# EAGLE design Central Control (EAGLE 9.4.2)
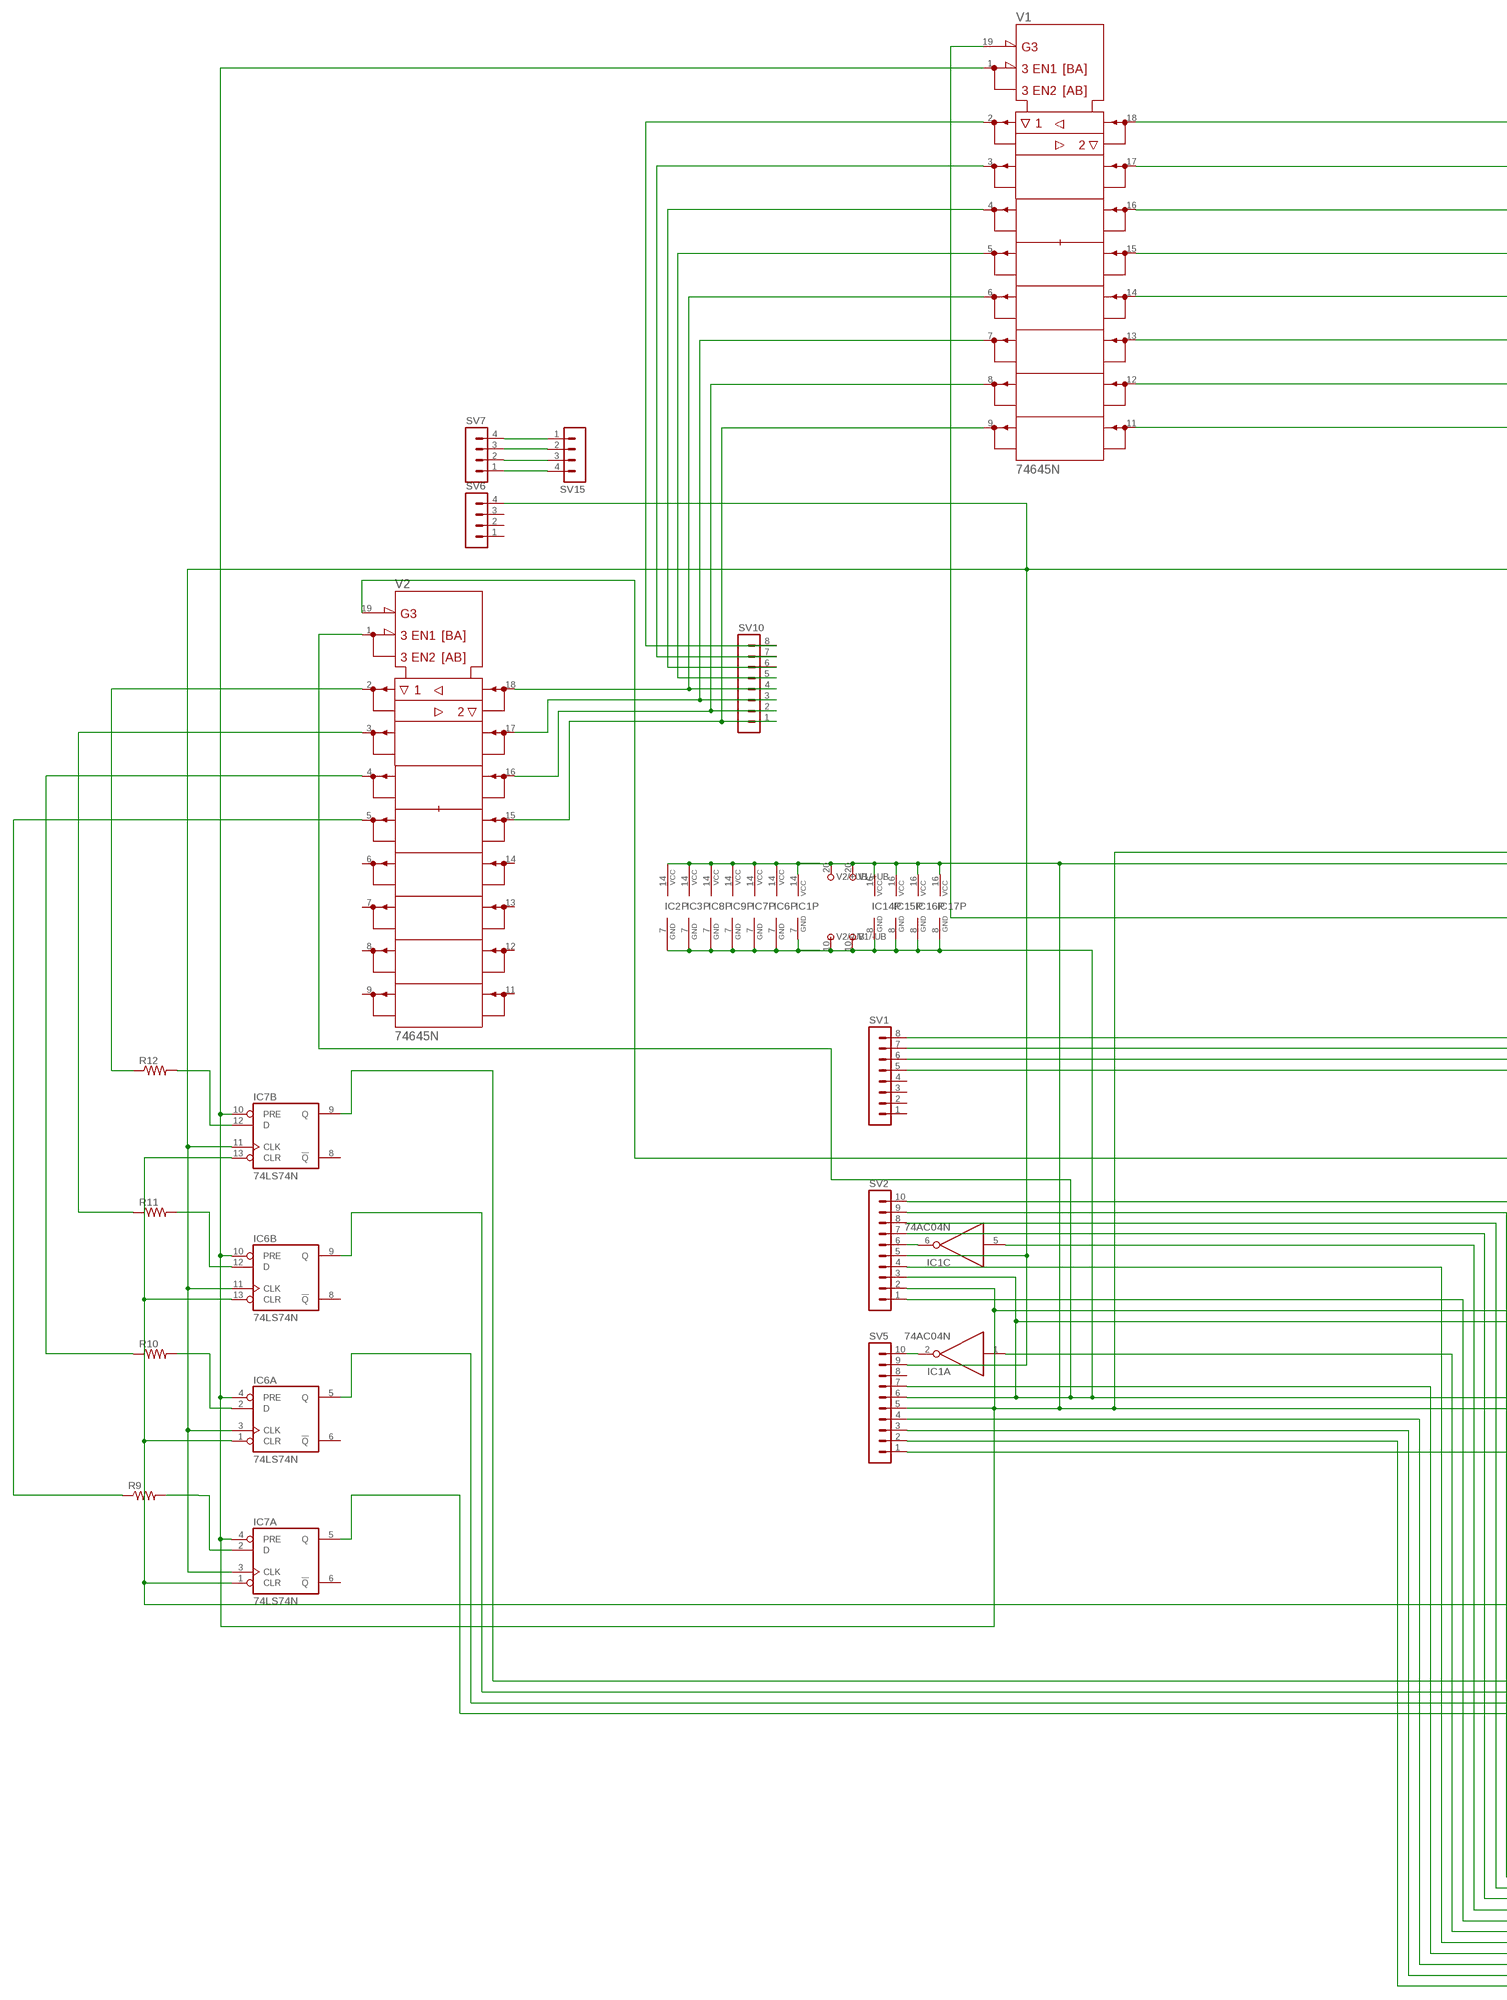
[diagram p0: schematic, sheet 1, part 1 of 3]
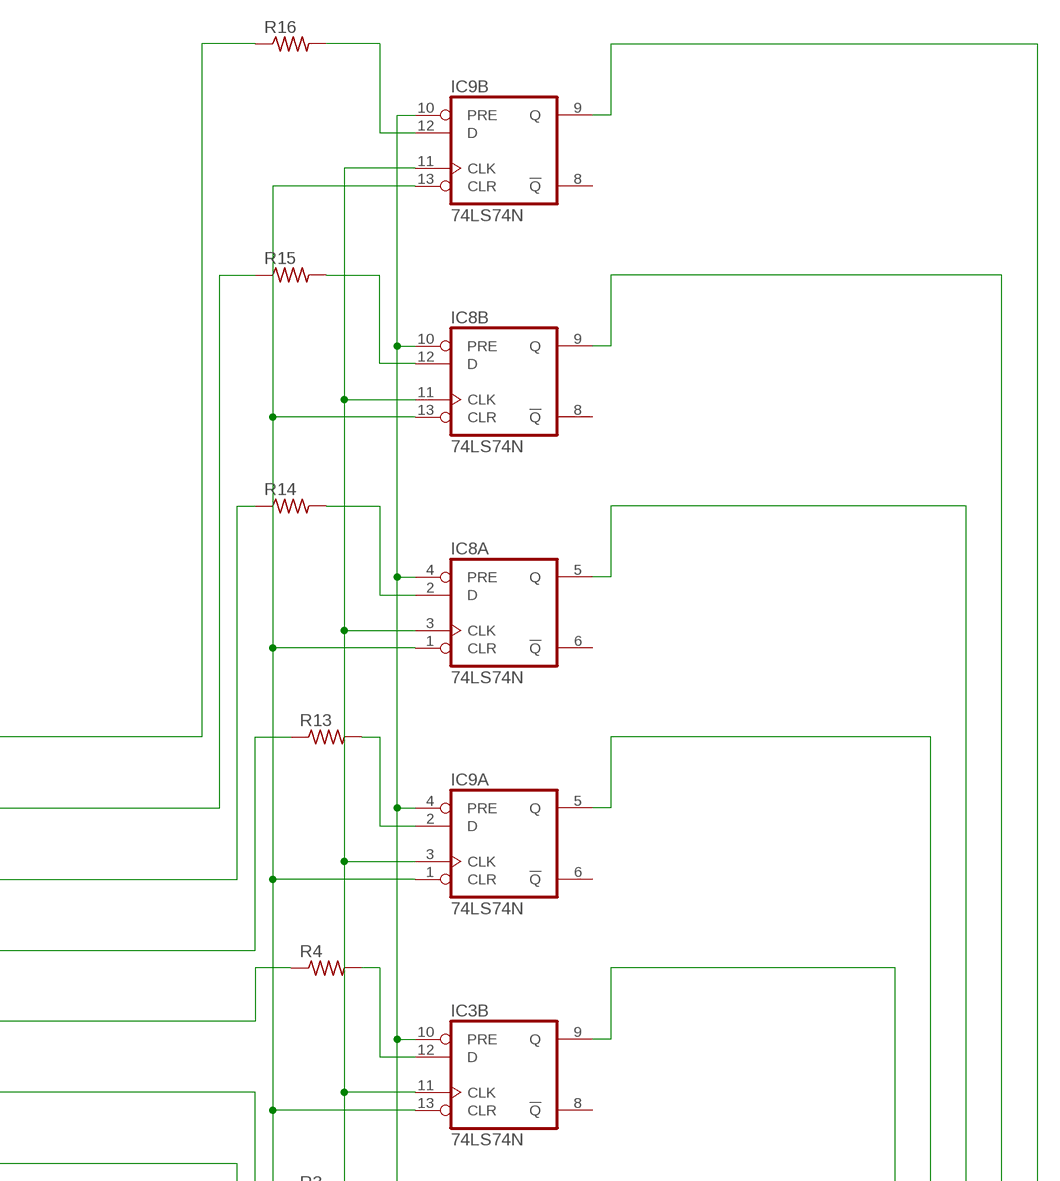
[diagram p1: schematic, sheet 1, part 2 of 3]
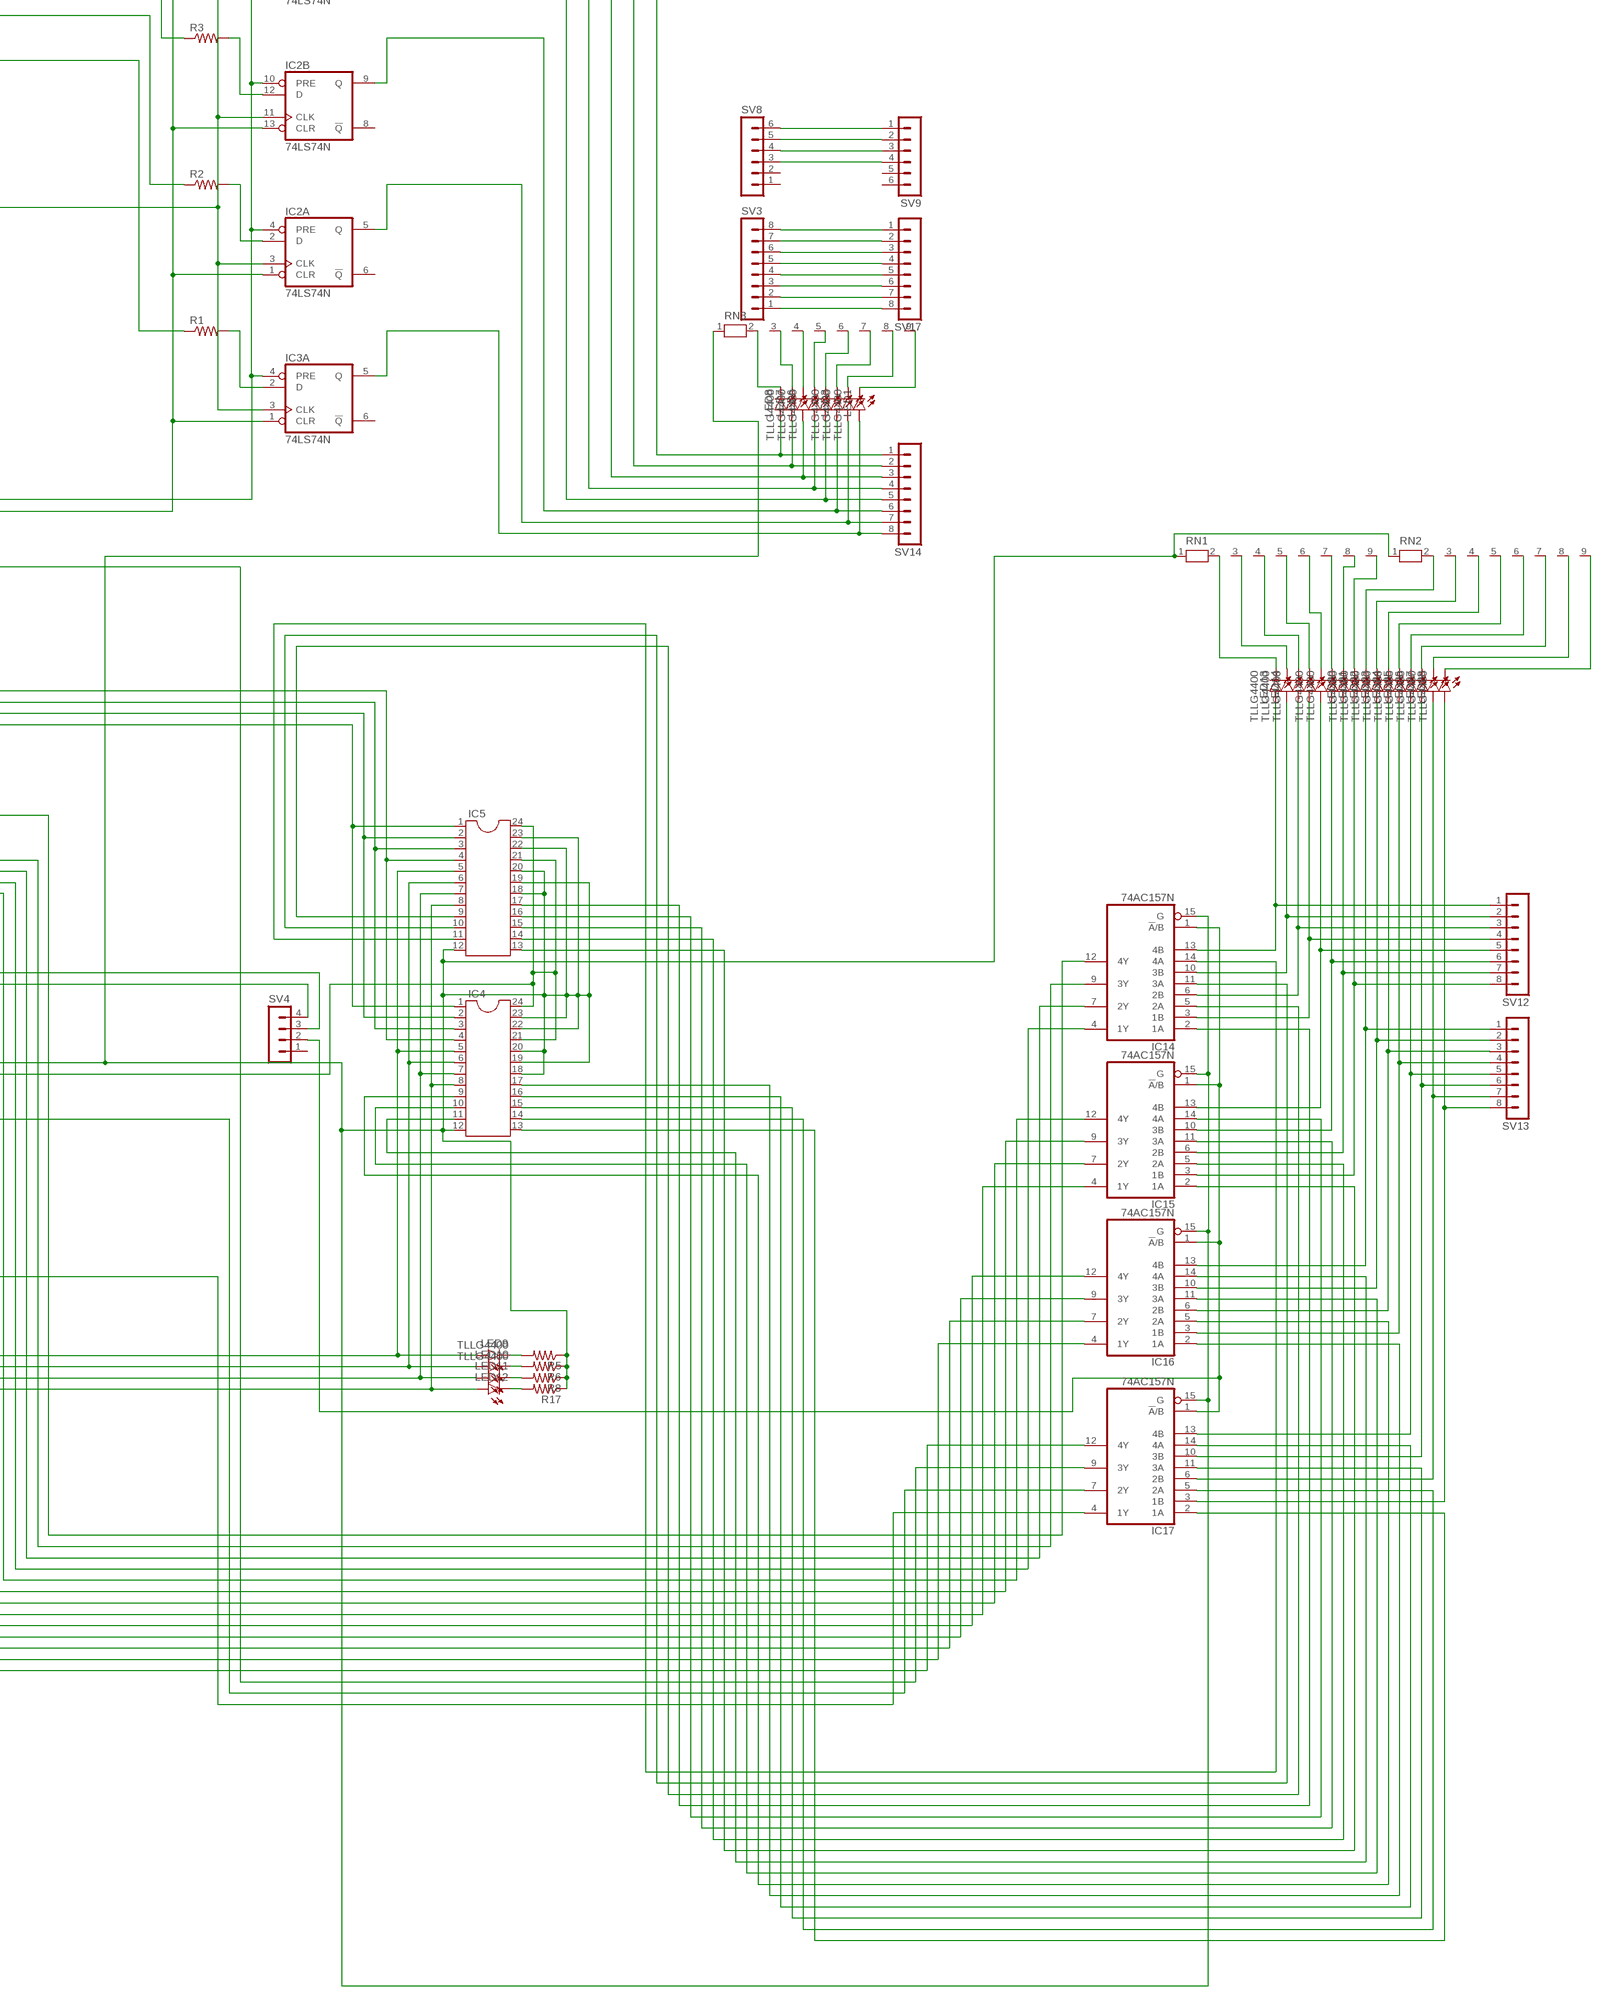
[diagram p2: schematic, sheet 1, part 3 of 3]

## Parts
IC1  74AC04N  [DIL14]
IC2  74LS74N  [DIL14]
IC3  74LS74N  [DIL14]
IC4  DIL24-6  [DIL24-6]
IC5  DIL24-6  [DIL24-6]
IC6  74LS74N  [DIL14]
IC7  74LS74N  [DIL14]
IC8  74LS74N  [DIL14]
IC9  74LS74N  [DIL14]
IC14  74AC157N  [DIL16]
IC15  74AC157N  [DIL16]
IC16  74AC157N  [DIL16]
IC17  74AC157N  [DIL16]
LED1  TLLG4400  [LED3MM]
LED2  TLLG4400  [LED3MM]
LED3  TLLG4400  [LED3MM]
LED4  TLLG4400  [LED3MM]
LED5  TLLG4400  [LED3MM]
LED6  TLLG4400  [LED3MM]
LED7  TLLG4400  [LED3MM]
LED8  TLLG4400  [LED3MM]
LED9  TLLG4400  [LED3MM]
LED10  TLLG4400  [LED3MM]
LED11  TLLG4400  [LED3MM]
LED12  TLLG4400  [LED3MM]
LED13  TLLG4400  [LED3MM]
LED14  TLLG4400  [LED3MM]
LED15  TLLG4400  [LED3MM]
LED16  TLLG4400  [LED3MM]
LED18  TLLG4400  [LED3MM]
LED19  TLLG4400  [LED3MM]
LED20  TLLG4400  [LED3MM]
LED21  TLLG4400  [LED3MM]
LED22  TLLG4400  [LED3MM]
LED23  TLLG4400  [LED3MM]
LED24  TLLG4400  [LED3MM]
LED25  TLLG4400  [LED3MM]
LED26  TLLG4400  [LED3MM]
LED27  TLLG4400  [LED3MM]
LED28  TLLG4400  [LED3MM]
LED29  TLLG4400  [LED3MM]
R1  R-US_0207/2V  [0207/2V]
R2  R-US_0207/2V  [0207/2V]
R3  R-US_0207/2V  [0207/2V]
R4  R-US_0207/2V  [0207/2V]
R5  R-US_0207/2V  [0207/2V]
R6  R-US_0207/2V  [0207/2V]
R8  R-US_0207/2V  [0207/2V]
R9  R-US_0207/2V  [0207/2V]
R10  R-US_0207/2V  [0207/2V]
R11  R-US_0207/2V  [0207/2V]
R12  R-US_0207/2V  [0207/2V]
R13  R-US_0207/2V  [0207/2V]
R14  R-US_0207/2V  [0207/2V]
R15  R-US_0207/2V  [0207/2V]
R16  R-US_0207/2V  [0207/2V]
R17  R-US_0207/2V  [0207/2V]
RN1  RN08  [RN-9]
RN2  RN08  [RN-9]
RN3  RN08  [RN-9]
SV1  MA08-1  [MA08-1]
SV2  MA10-1  [MA10-1]
SV3  MA08-1  [MA08-1]
SV4  MA04-1  [MA04-1]
SV5  MA10-1  [MA10-1]
SV6  MA04-1  [MA04-1]
SV7  MA04-1  [MA04-1]
SV8  MA06-1  [MA06-1]
SV9  MA06-1  [MA06-1]
SV10  MA08-1  [MA08-1]
SV12  MA08-1  [MA08-1]
SV13  MA08-1  [MA08-1]
SV14  MA08-1  [MA08-1]
SV15  MA04-1  [MA04-1]
SV17  MA08-1  [MA08-1]
V1  74645N  [DIL20]
V2  74645N  [DIL20]

## Nets
N$1: IC1.5(C:I) IC15.9(3Y)
N$2: IC4.8 IC5.8 IC7.5(A:Q) LED12.A
N$3: IC14.13(4B) LED13.A SV12.1
N$4: IC4.14 IC17.5(2A)
N$5: IC17.3(1B) LED29.A SV13.8
N$6: SV10.5 V1.5(A4)
N$7: SV10.6 V1.4(A3)
N$8: SV10.7 V1.3(A2)
N$9: SV10.8 V1.2(A1)
N$10: SV10.4 V1.6(A5) V2.18(B1)
N$11: IC4.1 IC5.1 SV1.5
N$12: SV10.3 V1.7(A6) V2.17(B2)
N$13: R10.1 V2.4(A3)
N$14: R9.1 V2.5(A4)
N$15: IC1.1(A:I) IC15.4(1Y)
N$16: IC3.9(B:Q) LED4.A SV14.5
N$17: IC17.6(2B) LED28.A SV13.7
N$18: IC17.10(3B) LED27.A SV13.6
N$19: IC4.16 IC17.14(4A)
N$20: IC1.7(P:GND) IC2.7(P:GND) IC3.7(P:GND) IC4.12 IC4.18 IC4.19 IC4.20 IC4.22 IC4.23 IC5.12 IC5.18 IC5.19 IC5.20 IC5.22 IC5.23 IC6.7(P:GND) IC7.7(P:GND) IC8.7(P:GND) IC9.7(P:GND) IC14.8(GND) IC14.15(G) IC15.8(GND) IC15.15(G) IC16.8(GND) IC16.15(G) IC17.8(GND) IC17.15(G) R5.1 R6.1 R8.1 R17.1 RN1.1 RN2.1 RN3.1 SV2.3 SV4.4 SV5.6 V1.10(-UB) V2.1(DIR) V2.10(-UB)
N$21: IC5.10 IC14.11(3A)
N$22: IC5.11 IC14.14(4A)
N$23: IC16.13(4B) LED22.A SV13.1
N$24: IC16.10(3B) LED23.A SV13.2
N$25: IC16.6(2B) LED24.A SV13.3
N$26: IC16.3(1B) LED25.A SV13.4
N$27: IC17.13(4B) LED26.A SV13.5
N$28: IC4.13 IC17.2(1A)
N$29: IC2.3(A:CLK) IC2.11(B:CLK) IC3.3(A:CLK) IC3.11(B:CLK) IC6.3(A:CLK) IC6.11(B:CLK) IC7.3(A:CLK) IC7.11(B:CLK) IC8.3(A:CLK) IC8.11(B:CLK) IC9.3(A:CLK) IC9.11(B:CLK) SV2.5 SV5.9 SV6.4
N$30: IC4.5 IC5.5 IC7.9(B:Q) LED9.A
N$31: R3.1 V1.13(B6)
N$32: R4.1 V1.14(B5)
N$33: IC4.6 IC5.6 IC6.9(B:Q) LED10.A
N$34: IC4.7 IC5.7 IC6.5(A:Q) LED11.A
N$35: R1.1 V1.11(B8)
N$36: IC2.9(B:Q) LED3.A SV14.6
N$37: IC2.5(A:Q) LED2.A SV14.7
N$38: IC3.5(A:Q) LED1.A SV14.8
N$39: IC4.2 IC5.2 SV1.6
N$40: IC4.4 IC5.4 SV1.8
N$41: R14.1 V1.16(B3)
N$42: IC4.3 IC5.3 SV1.7
N$43: IC17.9(3Y) V1.19(!G)
N$44: IC6.1(A:CLR) IC6.13(B:CLR) IC7.1(A:CLR) IC7.13(B:CLR) IC17.4(1Y)
N$45: SV7.4 SV15.1
N$46: R13.1 V1.15(B4)
N$47: IC9.9(B:Q) LED8.A SV14.1
N$48: IC8.9(B:Q) LED7.A SV14.2
N$49: IC9.5(A:Q) LED5.A SV14.4
N$50: R15.1 V1.17(B2)
N$51: IC8.5(A:Q) LED6.A SV14.3
N$52: SV7.3 SV15.2
N$53: IC14.10(3B) LED14.A SV12.2
N$54: R16.1 V1.18(B1)
N$55: R2.1 V1.12(B7)
N$56: IC1.14(P:VCC) IC2.1(A:CLR) IC2.4(A:PRE) IC2.10(B:PRE) IC2.13(B:CLR) IC2.14(P:VCC) IC3.1(A:CLR) IC3.4(A:PRE) IC3.10(B:PRE) IC3.13(B:CLR) IC3.14(P:VCC) IC4.21 IC4.24 IC5.21 IC5.24 IC6.4(A:PRE) IC6.10(B:PRE) IC6.14(P:VCC) IC7.4(A:PRE) IC7.10(B:PRE) IC7.14(P:VCC) IC8.1(A:CLR) IC8.4(A:PRE) IC8.10(B:PRE) IC8.13(B:CLR) IC8.14(P:VCC) IC9.1(A:CLR) IC9.4(A:PRE) IC9.10(B:PRE) IC9.13(B:CLR) IC9.14(P:VCC) IC14.16(VCC) IC15.16(VCC) IC16.16(VCC) IC17.16(VCC) SV2.2 SV4.3 SV5.5 V1.1(DIR) V1.20(+UB) V2.20(+UB)
N$57: SV7.2 SV15.3
N$58: SV7.1 SV15.4
N$59: SV8.6 SV9.1
N$60: SV8.5 SV9.2
N$61: SV8.4 SV9.3
N$62: SV8.3 SV9.4
N$63: SV3.8 SV17.1
N$64: SV3.7 SV17.2
N$65: SV3.6 SV17.3
N$66: SV3.5 SV17.4
N$67: SV3.4 SV17.5
N$68: SV3.3 SV17.6
N$69: SV3.2 SV17.7
N$70: SV3.1 SV17.8
N$71: R12.1 V2.2(A1)
N$72: SV10.2 V1.8(A7) V2.16(B3)
N$73: R11.1 V2.3(A2)
N$74: SV10.1 V1.9(A8) V2.15(B4)
N$75: IC14.7(2Y) SV2.9
N$76: IC1.6(C:O) SV2.6
N$77: IC14.3(1B) LED16.A SV12.4
N$78: IC14.6(2B) LED15.A SV12.3
N$79: IC15.13(4B) LED18.A SV12.5
N$80: LED7.K(C) RN3.3
N$81: IC7.12(B:D) R12.2
N$82: LED11.K(C) R8.2
N$83: IC6.12(B:D) R11.2
N$84: IC15.3(1B) LED21.A SV12.8
N$85: IC15.6(2B) LED20.A SV12.7
N$86: IC15.10(3B) LED19.A SV12.6
N$87: IC5.17 IC14.2(1A)
N$88: IC5.9 IC14.5(2A)
N$89: IC5.16 IC15.14(4A)
N$90: IC5.15 IC15.11(3A)
N$91: IC5.14 IC15.5(2A)
N$92: IC5.13 IC15.2(1A)
N$93: IC4.17 IC16.2(1A)
N$94: IC14.12(4Y) V2.19(!G)
N$95: IC14.1(!A!/B) IC15.1(!A!/B) IC16.1(!A!/B) IC17.1(!A!/B) SV4.2
N$96: IC1.2(A:O) SV5.10
N$97: IC4.10 IC16.11(3A)
N$98: IC14.4(1Y) SV2.8
N$99: IC15.12(4Y) SV2.7
N$100: IC4.15 IC17.11(3A)
N$101: IC15.7(2Y) SV2.1
N$102: IC4.9 IC16.5(2A)
N$103: IC16.12(4Y) SV2.4
N$104: IC16.7(2Y) SV5.4
N$105: IC16.9(3Y) SV5.7
N$106: IC4.11 IC16.14(4A)
N$107: IC17.12(4Y) SV5.2
N$108: IC17.7(2Y) SV5.1
N$109: IC6.2(A:D) R10.2
N$110: IC7.2(A:D) R9.2
N$111: IC9.12(B:D) R16.2
N$112: IC16.4(1Y) SV5.3
N$113: IC14.9(3Y) SV2.10
N$114: IC8.12(B:D) R15.2
N$115: IC8.2(A:D) R14.2
N$116: IC9.2(A:D) R13.2
N$117: IC3.12(B:D) R4.2
N$118: IC2.12(B:D) R3.2
N$119: IC2.2(A:D) R2.2
N$120: IC3.2(A:D) R1.2
N$121: LED13.K(C) RN1.2
N$122: LED14.K(C) RN1.3
N$123: LED15.K(C) RN1.4
N$124: LED16.K(C) RN1.5
N$125: LED18.K(C) RN1.6
N$126: LED19.K(C) RN1.7
N$127: LED20.K(C) RN1.8
N$128: LED21.K(C) RN1.9
N$129: LED22.K(C) RN2.2
N$130: LED23.K(C) RN2.3
N$131: LED24.K(C) RN2.4
N$132: LED25.K(C) RN2.5
N$133: LED26.K(C) RN2.6
N$134: LED27.K(C) RN2.7
N$135: LED28.K(C) RN2.8
N$136: LED29.K(C) RN2.9
N$137: LED8.K(C) RN3.2
N$138: LED6.K(C) RN3.4
N$139: LED5.K(C) RN3.5
N$140: LED4.K(C) RN3.6
N$141: LED3.K(C) RN3.7
N$142: LED2.K(C) RN3.8
N$143: LED1.K(C) RN3.9
N$144: LED9.K(C) R5.2
N$145: LED10.K(C) R6.2
N$146: LED12.K(C) R17.2
Unconnected: IC1.3(B:I) IC1.4(B:O) IC1.8(D:O) IC1.9(D:I) IC1.10(E:O) IC1.11(E:I) IC1.12(F:O) IC1.13(F:I) IC2.6(A:!Q) IC2.8(B:!Q) IC3.6(A:!Q) IC3.8(B:!Q) IC6.6(A:!Q) IC6.8(B:!Q) IC7.6(A:!Q) IC7.8(B:!Q) IC8.6(A:!Q) IC8.8(B:!Q) IC9.6(A:!Q) IC9.8(B:!Q) SV1.1 SV1.2 SV1.3 SV1.4 SV4.1 SV5.8 SV6.1 SV6.2 SV6.3 SV8.1 SV8.2 SV9.5 SV9.6 V2.6(A5) V2.7(A6) V2.8(A7) V2.9(A8) V2.11(B8) V2.12(B7) V2.13(B6) V2.14(B5)

## Library data of the parts
IC1 = 74xx-eu:74*04: Hex INVERTER
IC2 IC3 IC6-IC9 = 74xx-us:74*74: Dual D type positive edge triggered FLIP FLOP, preset and clear
IC4 IC5 = ic-package:DIL24: Dual In Line
IC14-IC17 = 74xx-eu:74*157: Quadruple 2-line to 1-line data SELECTOR/MULTIPLEXER
LED1-LED16 LED18-LED29 = led:TLLG4400: Low Current (2mA) LED 3 mm Tinted Diffused Package color GREEN Source: Data sheet <http://www.farnell.com/datasheets/391098.pdf>; MF: VISHAY SEMICONDUCTOR; OC_FARNELL: 1612435
R1-R6 R8-R17 = rcl:R-US_: RESISTOR, American symbol; SPICEPREFIX: R
RN1-RN3 = resistor-net:RN08: RESISTOR NETWORK; OC_FARNELL: unknown; OC_NEWARK: unknown
SV1 SV3 SV10 SV12-SV14 SV17 = con-lstb:MA08-1: PIN HEADER; OC_FARNELL: unknown; OC_NEWARK: unknown
SV2 SV5 = con-lstb:MA10-1: PIN HEADER; OC_FARNELL: unknown; OC_NEWARK: unknown
SV4 SV6 SV7 SV15 = con-lstb:MA04-1: PIN HEADER; OC_FARNELL: unknown; OC_NEWARK: unknown
SV8 SV9 = con-lstb:MA06-1: PIN HEADER; OC_FARNELL: unknown; OC_NEWARK: unknown
V1 V2 = 74ttl-din:74*645: Octal bus TRANSCEIVER 3-state

## Net classes
0 default: width 0.381 mm, drill 0.508 mm, clearance 0.254 mm

## Board
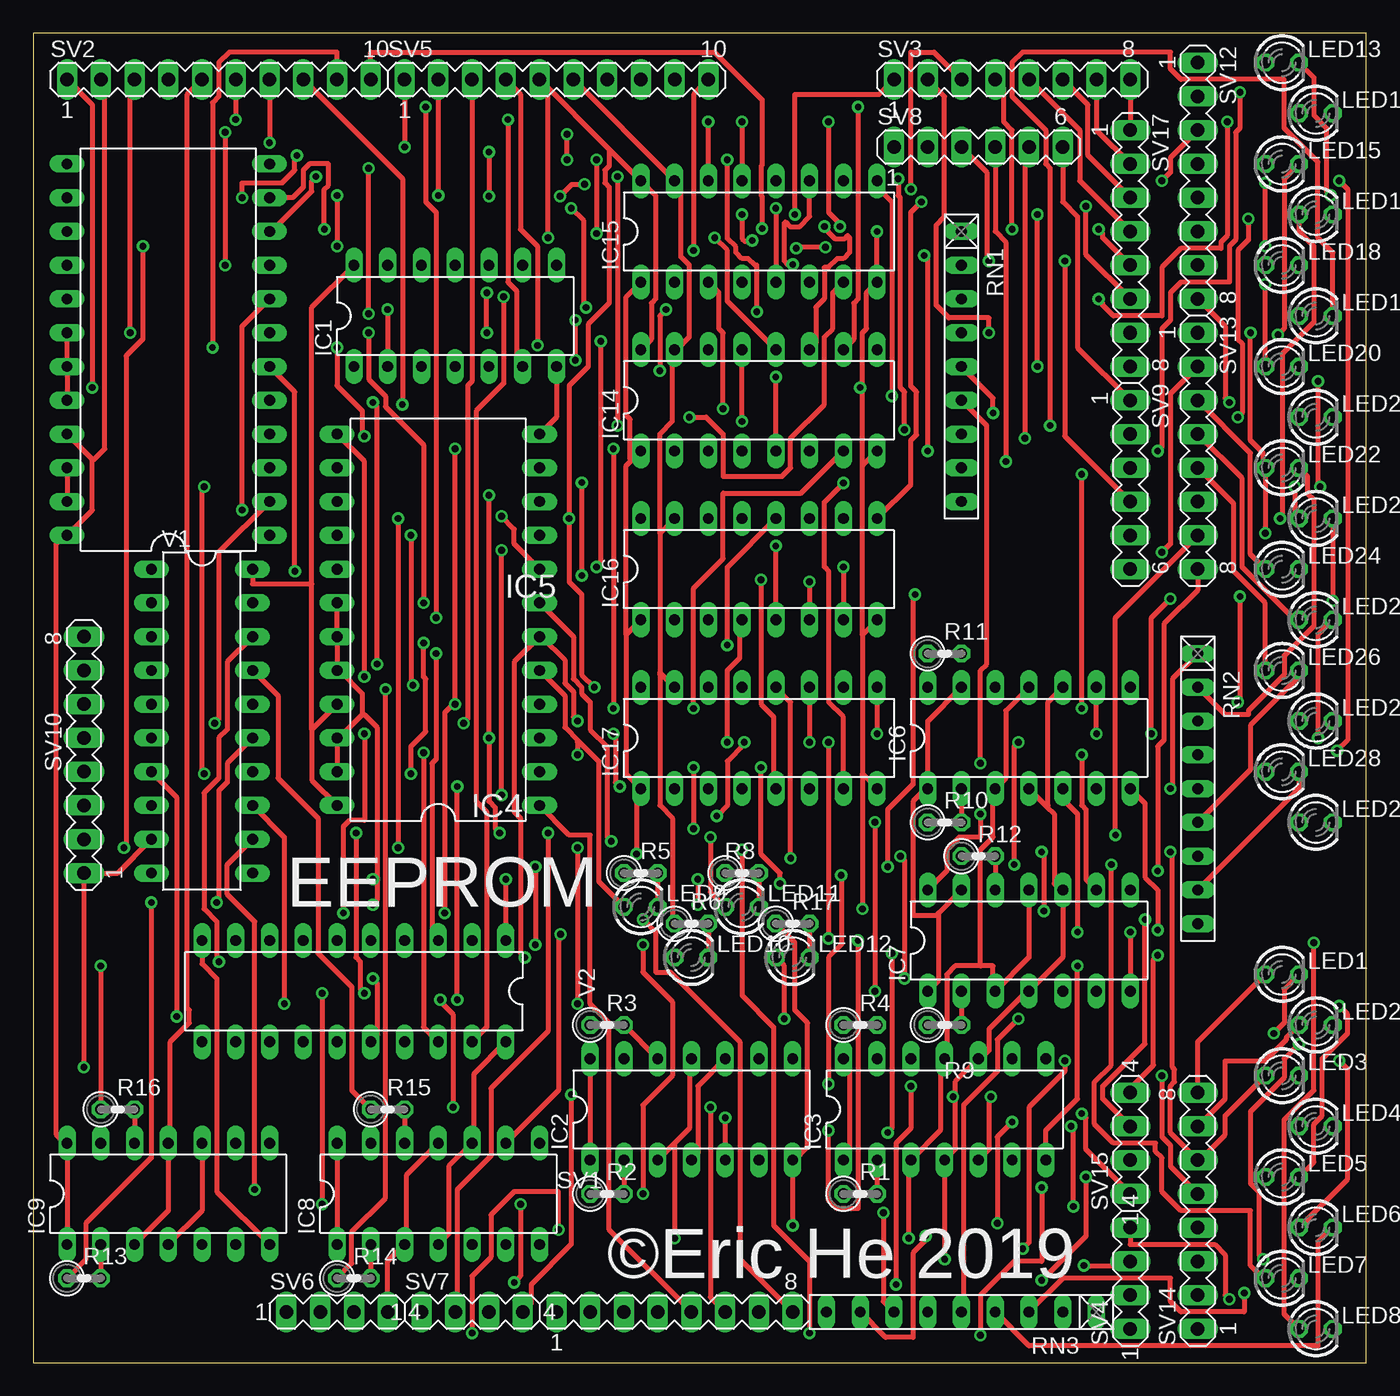
[diagram p3: board, top side]
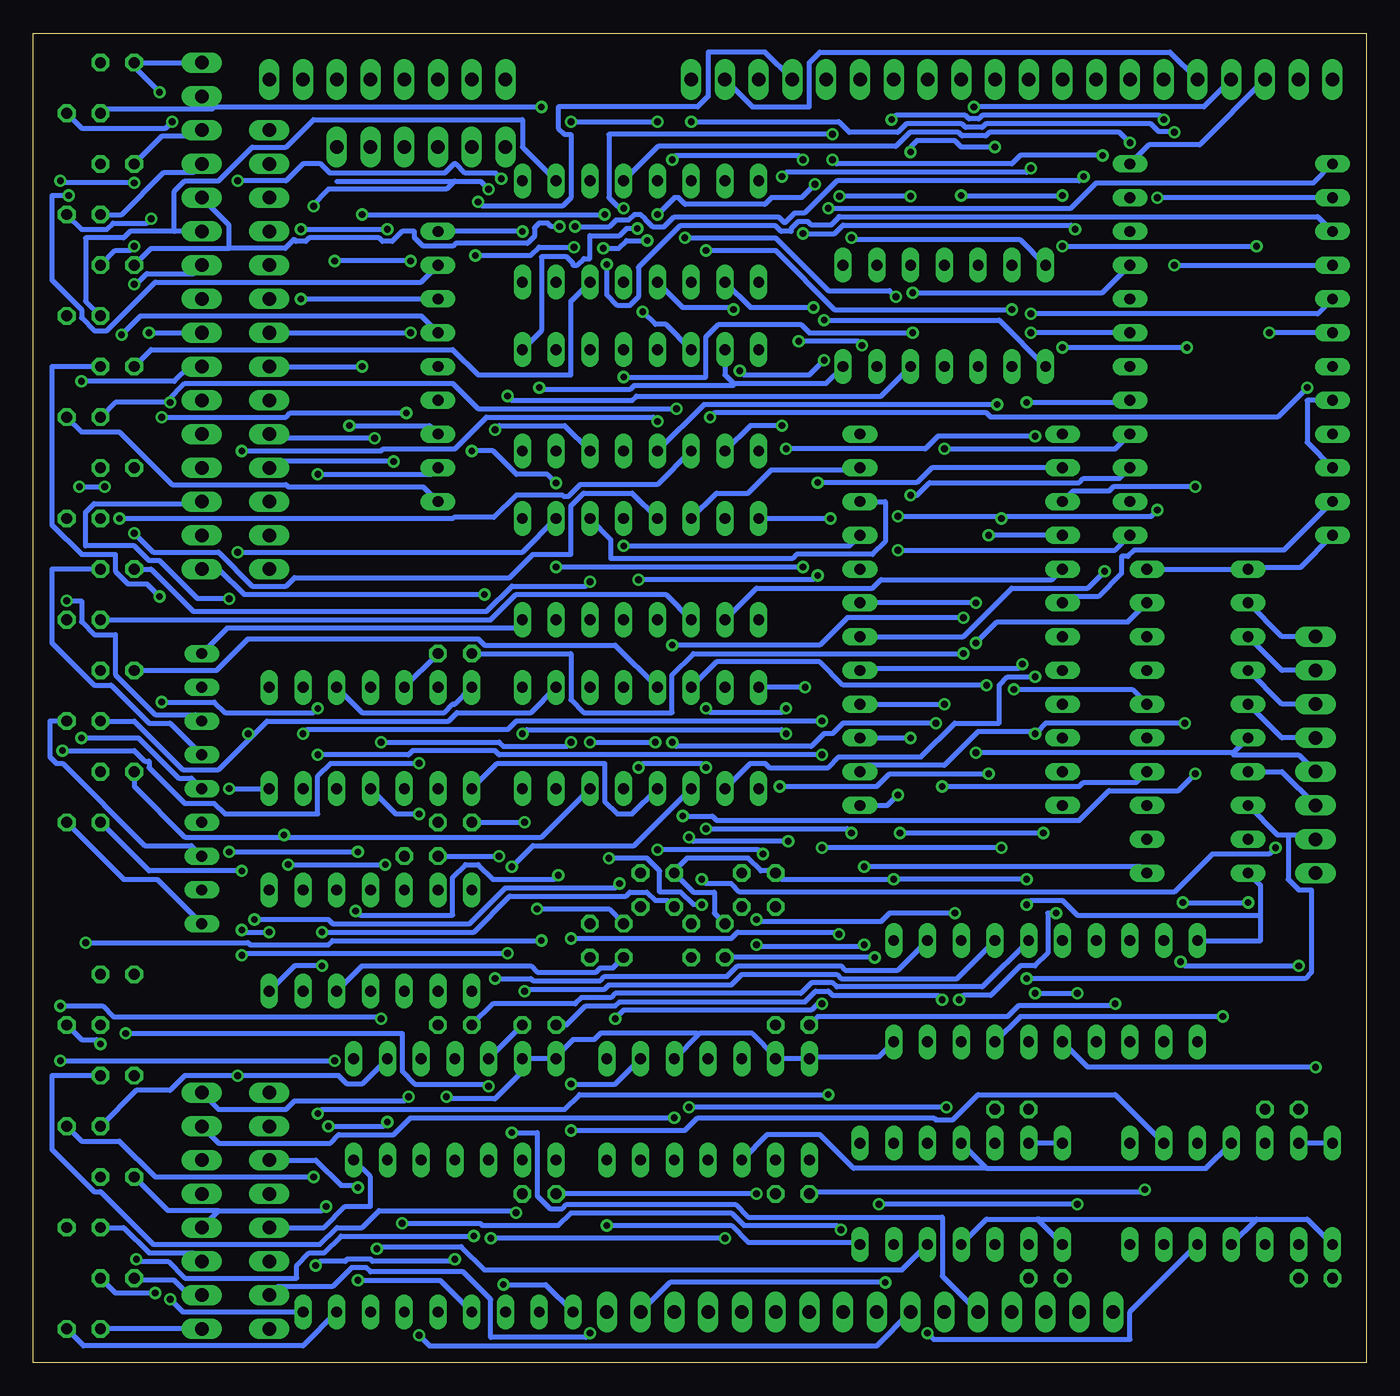
[diagram p4: board, bottom side, seen from below]

Size 100.31 x 100 mm. Coordinates in mm from the lower left corner, seen from the top.
Outline: 0,0 100.31,0 100.31,100 0,100 0,0
Copper layers (1*16): Top 0.035mm / dielectric 1.5mm / Bottom 0.035mm
Design rules "default": minimum track width 6mil, minimum drill 0.35mm, track to track 6mil, track to pad 6mil, pad to pad 6mil, via to via 6mil, smd to smd 6mil, copper to edge 40mil, drill to drill 6mil, minimum pad ring 10mil, minimum via ring 8mil, stop-mask expansion 4mil, vias tented up to drill 0mil, thermal gap 10mil

### Footprints (pad centres in the part's own frame; a part is rotated, then mirrored left to right if it is on the bottom)
DIL14 = drill 0.813 long: 1 -7.62,-3.81; 2 -5.08,-3.81; 3 -2.54,-3.81; 4 0,-3.81; 5 2.54,-3.81; 6 5.08,-3.81; 7 7.62,-3.81; 8 7.62,3.81; 9 5.08,3.81; 10 2.54,3.81; 11 0,3.81; 12 -2.54,3.81; 13 -5.08,3.81; 14 -7.62,3.81
DIL24-6 = drill 0.813 long: 1 -13.97,-7.62; 2 -11.43,-7.62; 3 -8.89,-7.62; 4 -6.35,-7.62; 5 -3.81,-7.62; 6 -1.27,-7.62; 7 1.27,-7.62; 8 3.81,-7.62; 9 6.35,-7.62; 10 8.89,-7.62; 11 11.43,-7.62; 12 13.97,-7.62; 13 13.97,7.62; 14 11.43,7.62; 15 8.89,7.62; 16 6.35,7.62; 17 3.81,7.62; 18 1.27,7.62; 19 -1.27,7.62; 20 -3.81,7.62; 21 -6.35,7.62; 22 -8.89,7.62; 23 -11.43,7.62; 24 -13.97,7.62
DIL16 = drill 0.813 long: 1 -8.89,-3.81; 2 -6.35,-3.81; 3 -3.81,-3.81; 4 -1.27,-3.81; 5 1.27,-3.81; 6 3.81,-3.81; 7 6.35,-3.81; 8 8.89,-3.81; 9 8.89,3.81; 10 6.35,3.81; 11 3.81,3.81; 12 1.27,3.81; 13 -1.27,3.81; 14 -3.81,3.81; 15 -6.35,3.81; 16 -8.89,3.81
LED3MM = drill 0.813 octagon: A -1.27,0; K 1.27,0
0207/2V = drill 0.813 octagon: 1 -1.27,0; 2 1.27,0
RN-9 = drill 0.813 long: 1 -10.16,0; 2 -7.62,0; 3 -5.08,0; 4 -2.54,0; 5 0,0; 6 2.54,0; 7 5.08,0; 8 7.62,0; 9 10.16,0
MA08-1 = drill 1.016 long: 1 -8.89,0; 2 -6.35,0; 3 -3.81,0; 4 -1.27,0; 5 1.27,0; 6 3.81,0; 7 6.35,0; 8 8.89,0
MA10-1 = drill 1.016 long: 1 -11.43,0; 2 -8.89,0; 3 -6.35,0; 4 -3.81,0; 5 -1.27,0; 6 1.27,0; 7 3.81,0; 8 6.35,0; 9 8.89,0; 10 11.43,0
MA04-1 = drill 1.016 long: 1 -3.81,0; 2 -1.27,0; 3 1.27,0; 4 3.81,0
MA06-1 = drill 1.016 long: 1 -6.35,0; 2 -3.81,0; 3 -1.27,0; 4 1.27,0; 5 3.81,0; 6 6.35,0
DIL20 = drill 0.813 long: 1 -11.43,-3.81; 2 -8.89,-3.81; 3 -6.35,-3.81; 4 -3.81,-3.81; 5 -1.27,-3.81; 6 1.27,-3.81; 7 3.81,-3.81; 8 6.35,-3.81; 9 8.89,-3.81; 10 11.43,-3.81; 11 11.43,3.81; 12 8.89,3.81; 13 6.35,3.81; 14 3.81,3.81; 15 1.27,3.81; 16 -1.27,3.81; 17 -3.81,3.81; 18 -6.35,3.81; 19 -8.89,3.81; 20 -11.43,3.81

### Placement (x,y rotation side)
IC1  31.75,78.74 0 top
IC2  49.53,19.05 0 top
IC3  68.58,19.05 0 top
IC4  30.48,55.88 90 top
IC5  10.16,76.2 90 top
IC6  74.93,46.99 0 top
IC7  74.93,31.75 0 top
IC8  30.48,12.7 0 top
IC9  10.16,12.7 0 top
IC14  54.61,72.39 0 top
IC15  54.61,85.09 0 top
IC16  54.61,59.69 0 top
IC17  54.61,46.99 0 top
LED1  93.98,29.21 0 top
LED2  96.52,25.4 0 top
LED3  93.98,21.59 0 top
LED4  96.52,17.78 0 top
LED5  93.98,13.97 0 top
LED6  96.52,10.16 0 top
LED7  93.98,6.35 0 top
LED8  96.52,2.54 0 top
LED9  45.72,34.29 0 top
LED10  49.53,30.48 0 top
LED11  53.34,34.29 0 top
LED12  57.15,30.48 0 top
LED13  93.98,97.79 0 top
LED14  96.52,93.98 0 top
LED15  93.98,90.17 0 top
LED16  96.52,86.36 0 top
LED18  93.98,82.55 0 top
LED19  96.52,78.74 0 top
LED20  93.98,74.93 0 top
LED21  96.52,71.12 0 top
LED22  93.98,67.31 0 top
LED23  96.52,63.5 0 top
LED24  93.98,59.69 0 top
LED25  96.52,55.88 0 top
LED26  93.98,52.07 0 top
LED27  96.52,48.26 0 top
LED28  93.98,44.45 0 top
LED29  96.52,40.64 0 top
R1  62.23,12.7 0 top
R2  43.18,12.7 0 top
R3  43.18,25.4 0 top
R4  62.23,25.4 0 top
R5  45.72,36.83 0 top
R6  49.53,33.02 0 top
R8  53.34,36.83 0 top
R9  68.58,25.4 0 top
R10  68.58,40.64 0 top
R11  68.58,53.34 0 top
R12  71.12,38.1 0 top
R13  3.81,6.35 0 top
R14  24.13,6.35 0 top
R15  26.67,19.05 0 top
R16  6.35,19.05 0 top
R17  57.15,33.02 0 top
RN1  69.85,74.93 270 top
RN2  87.63,43.18 270 top
RN3  69.85,3.81 180 top
SV1  48.26,3.81 0 top
SV2  13.97,96.52 0 top
SV3  73.66,96.52 0 top
SV4  82.55,6.35 90 top
SV5  39.37,96.52 0 top
SV6  22.86,3.81 0 top
SV7  33.02,3.81 0 top
SV8  71.12,91.44 0 top
SV9  82.55,66.04 270 top
SV10  3.81,45.72 90 top
SV12  87.63,88.9 270 top
SV13  87.63,68.58 270 top
SV14  87.63,11.43 90 top
SV15  82.55,16.51 90 top
SV17  82.55,83.82 270 top
V1  12.7,48.26 270 top
V2  24.13,27.94 180 top

### Tracks (layer width: path | path; a pad name or v marks a point on that pad's centre or on a via)
N$1  (via drill 0.51)
  Top 0.381: v64.61,72.71 64.61,87.31 63.5,88.42 IC15.9
  Bottom 0.381: IC1.5 36.51,72.71 54.93,72.71 55.24,72.39 64.29,72.39 v64.61,72.71
N$2  (via drill 0.51)
  Top 0.381: IC5.8 15.72,77.95 v15.72,64.14 | v35.24,63.66 36.2,62.71 36.2,61.59 IC4.8 | LED12.A 56.52,29.84 v56.52,25.88 | v40.96,38.73 v40.96,26.99 | v27.46,63.5 v27.46,38.73
  Bottom 0.381: LED12.A 56.67,29.69 57.63,29.69 57.94,29.37 62.39,29.37 62.87,29.84 75.56,29.84 IC7.5 | v15.72,64.14 16.19,63.66 27.46,63.66 | v35.24,63.66 27.46,63.66 | v56.52,25.88 55.88,26.51 41.75,26.51 41.27,26.99 v40.96,26.99 | v27.46,38.73 v40.96,38.73 | v27.46,63.5 27.46,63.66
N$3  (via drill 0.51)
  Top 0.381: v53.34,70.8 IC14.13 | v84.61,68.58 84.93,68.9 84.93,77.79 85.57,78.42 85.57,80.49 86.36,81.28 90.01,81.28 90.01,83.98 90.49,84.45 90.49,92.55 90.81,92.87 v90.81,95.57
  Bottom 0.381: v53.34,70.8 53.66,71.12 66.2,71.12 68.58,68.74 73.98,68.74 74.14,68.58 v84.61,68.58 | v90.81,95.57 92.71,97.47 LED13.A SV12.1
N$4  (via drill 0.51)
  Top 0.381: IC17.5 55.72,43.34 55.72,48.58 54.77,49.53 v54.77,58.9 | v41.27,66.2 v41.27,59.21
  Bottom 0.381: v54.77,58.9 41.59,58.9 v41.27,59.21 | v41.27,66.2 33.81,66.2 32.7,67.31 IC4.14
N$5  (via drill 0.51)
  Top 0.381: v64.29,37.31 64.29,41.59 66.2,43.5 66.2,57.63 v66.36,57.78 | v84.61,36.99 84.61,46.35 85.09,46.83 85.09,55.56 87.63,58.1 SV13.8
  Bottom 0.381: IC17.3 55.09,38.89 62.71,38.89 v64.29,37.31 | v66.36,57.78 84.45,57.78 86.36,59.69 SV13.8 | LED29.A 91.6,36.99 v84.61,36.99
N$6
  Bottom 0.381: V1.5 6.35,46.99 SV10.5
N$7
  Bottom 0.381: V1.4 6.35,49.53 SV10.6
N$8
  Bottom 0.381: V1.3 6.35,52.07 SV10.7
N$9
  Bottom 0.381: V1.2 6.35,54.61 SV10.8
N$10  (via drill 0.51)
  Top 0.381: V2.18 29.37,25.24 v29.37,45.88
  Bottom 0.381: 10,45.88 v29.37,45.88 | V1.6 10,45.88 | SV10.4 5.08,45.72 10,45.72 10,45.88
N$11  (via drill 0.51)
  Top 0.381: IC4.1 40.32,39.69 41.91,39.69 41.91,26.99 43.34,25.56 43.34,10 SV1.5 | v35.24,42.7 v35.24,61.12
  Bottom 0.381: IC5.1 18.89,61.12 v35.24,61.12 | v35.24,42.7 36.04,41.91 IC4.1
N$12  (via drill 0.51)
  Top 0.381: v10.79,26.04 10.79,42.55 V1.7
  Bottom 0.381: V2.17 26.04,26.04 v10.79,26.04 | SV10.3 6.35,44.45 V1.7
N$13  (via drill 0.51)
  Top 0.381: v63.34,40.64 v63.34,27.94
  Bottom 0.381: V2.4 30.8,28.89 39.53,28.89 39.85,29.21 46.99,29.21 47.78,28.42 56.99,28.42 57.31,28.1 63.18,28.1 v63.34,27.94 | R10.1 v63.34,40.64
N$14
  Bottom 0.381: R9.1 65.72,26.99 59.53,26.99 59.05,27.46 56.83,27.46 56.52,27.78 42.55,27.78 41.75,28.57 40.16,28.57 39.85,28.26 28.89,28.26 V2.5
N$15  (via drill 0.51)
  Top 0.381: v40.8,75.41 v40.8,78.42 | v47.15,74.61 47.15,78.74 v47.62,79.22
  Bottom 0.381: IC1.1 27.62,78.42 v40.8,78.42 | v40.8,75.41 41.91,74.3 46.83,74.3 v47.15,74.61 | v47.62,79.22 47.78,79.38 51.44,79.38 IC15.4
N$16  (via drill 0.51)
  Top 0.381: SV14.5 85.57,14.76 85.57,16.35 84.93,16.99 v84.93,21.59
  Bottom 0.381: LED4.A 92.55,20.48 90.01,20.48 88.9,21.59 v84.93,21.59 77.31,21.59 76.68,20.95 75.56,20.95 IC3.9
N$17  (via drill 0.51)
  Top 0.381: SV13.7 81.44,56.04 v81.44,39.69
  Bottom 0.381: IC17.6 62.07,39.53 81.44,39.53 | 81.44,39.53 88.9,39.53 92.71,43.34 LED28.A | v81.44,39.69 81.44,39.53
N$18  (via drill 0.51)
  Top 0.381: v85.57,57.47 84.14,56.04 v84.14,47.31
  Bottom 0.381: IC17.10 62.87,48.9 68.42,48.9 69.06,48.26 82.71,48.26 83.74,47.23 | 83.74,47.23 86.36,44.61 89.06,44.61 92.71,48.26 LED27.A | SV13.6 87.79,64.61 95.73,64.61 96.36,63.98 96.36,61.44 92.71,61.44 91.6,60.33 90.81,60.33 87.95,57.47 v85.57,57.47 | v84.14,47.31 83.82,47.31 83.74,47.23
N$19  (via drill 0.51)
  Top 0.381: v28.57,50.96 28.42,51.12 v28.42,62.23
  Bottom 0.381: IC17.14 48.9,52.7 41.12,52.7 39.37,50.96 v28.57,50.96 | IC4.16 v28.42,62.23
N$20  (via drill 0.51)
  Top 0.381: v57.15,10.32 IC2.7 57.31,15.24 58.26,16.19 58.26,25.56 57.31,26.51 57.31,31.59 R17.1 | v90.01,4.76 89.69,5.08 89.69,8.1 88.9,8.89 82.55,8.89 SV4.4 | v78.58,29.84 78.58,19.84 76.2,17.46 IC3.7 | v85.57,43.18 85.72,43.34 85.72,51.44 RN2.1 | 62.47,44.21 62.39,44.29 62.39,54.77 | 62.47,44.21 IC17.8 | IC16.8 62.39,54.77 | 62.47,67.55 62.39,67.47 62.39,54.77 | 62.47,67.55 IC14.8 | 62.39,73.34 62.39,67.63 62.47,67.55 | 62.39,73.34 62.39,77.47 62.71,77.79 62.71,80.49 IC15.8 v63.5,85.09 | v82.55,32.38 IC7.7 | v84.61,32.54 84.61,35.56 83.66,36.51 83.66,42.07 IC6.7 | v62.39,34.13 62.39,44.13 62.47,44.21 | v35.56,36.35 V2.1 | IC4.12 39.37,71.12 IC1.7 | 47.23,51.83 47.15,51.91 47.15,62.39 | 47.23,51.83 IC17.15 | IC16.15 47.15,62.39 | 47.15,62.39 47.15,69.85 48.1,70.8 48.1,76.04 IC14.15 48.42,76.2 49.37,77.15 49.37,82.55 48.74,83.19 48.74,88.42 IC15.15 48.1,88.9 48.1,89.06 SV5.6 | R6.1 48.1,33.18 48.1,40.96 47.15,41.91 47.15,51.75 47.23,51.83 | IC9.7 13.81,12.86 13.81,28.89 12.7,30 V2.10 | IC4.23 IC4.22 23.02,46.99 24.77,48.74 | IC4.18 IC4.19 IC4.20 23.02,52.07 24.77,50.32 24.77,48.74 | IC5.22 IC5.23 | IC5.20 IC5.19 IC5.18 | SV2.3 7.3,96.2 v7.3,77.47 | v25.56,34.45 25.88,34.77 25.88,36.35 | 25.88,36.35 25.88,47.78 24.92,48.74 24.77,48.74 | v25.56,36.35 25.88,36.35 | v62.23,73.34 62.39,73.34
  Bottom 0.381: IC8.7 38.26,9.05 46.51,9.05 47.78,10.32 v57.15,10.32 | IC3.7 74.93,13.97 74.93,11.75 76.83,11.75 78.42,10.16 SV4.4 | RN3.1 89.06,3.81 v90.01,4.76 | IC7.7 80.64,29.84 v78.58,29.84 | v85.57,43.18 IC6.7 | v63.5,85.09 RN1.1 | RN2.1 85.72,55.24 64.14,55.24 IC16.8 | v82.55,32.38 84.45,32.38 v84.61,32.54 | R17.1 56.99,34.13 v62.39,34.13 | R6.1 49.05,33.81 49.05,35.4 50.64,35.4 R8.1 52.07,36.99 51.12,37.94 46.51,37.94 45.56,36.99 44.45,36.99 R5.1 43.97,36.35 v35.56,36.35 v25.56,36.35 | IC1.7 40.64,73.66 47.62,73.66 | 47.62,73.66 48.26,74.3 IC14.15 | V1.10 7.94,35.88 7.94,33.66 | 7.94,33.66 7.94,31.75 V2.10 | IC5.12 16.35,91.6 12.54,91.6 SV2.3 | IC5.22 4.45,69.22 4.45,72.39 IC5.20 | IC4.18 22.38,57.63 20.16,57.63 18.41,59.37 18.41,60.64 17.94,60.64 17.46,61.12 6.19,61.12 IC5.23 | IC5.18 v7.3,77.47 | 7.94,33.66 21.75,33.66 22.86,34.77 25.24,34.77 v25.56,34.45 | v62.23,73.34 62.07,73.18 55.4,73.18 55.09,73.5 47.62,73.5 47.62,73.66
N$21  (via drill 0.51)
  Top 0.381: IC14.11 58.9,76.68 58.9,79.38 59.53,80.01 59.53,82.39 59.85,82.39 60.5,83.05 60.96,83.05 61.44,83.52 61.44,84.61 61.28,84.77 61.07,84.56 60.33,84.56 59.8,85.08 59.8,85.19 v59.53,85.46 | v21.27,89.22 20.95,88.9 20.95,88.11 17.94,85.09 IC5.10
  Bottom 0.381: v21.27,89.22 21.59,88.9 39.85,88.9 42.28,86.47 43.02,86.47 43.74,85.75 43.79,85.75 44.19,86.15 52.12,86.15 52.86,85.41 53.66,85.41 54.24,85.99 54.61,86.36 55.08,86.36 55.51,85.94 56.46,85.94 56.99,85.41 59.48,85.41 v59.53,85.46
N$22  (via drill 0.51)
  Top 0.381: IC5.11 19.53,87.63 20.32,88.42 20.32,89.69 20.8,90.17 22.23,90.17 22.23,88.58 21.91,88.27 v21.91,85.25 | v42.39,90.49 v42.39,84.93 | v54.45,79.06 54.45,82.55 54.29,82.55 53.8,83.05 53.34,83.05 52.86,83.52 52.86,83.92 52.23,84.56 v52.23,90.49
  Bottom 0.381: v21.91,85.25 22.23,85.57 39.37,85.57 40.01,84.93 v42.39,84.93 | v42.39,90.49 42.7,90.81 51.91,90.81 v52.23,90.49 | v54.45,79.06 53.5,78.11 52.7,78.11 IC14.14
N$23  (via drill 0.51)
  Top 0.381: v92.71,62.39 LED22.A 92.55,67.31 92.55,68.42 91.6,69.37 v91.6,77.47
  Bottom 0.381: IC16.13 55.24,65.41 58.9,65.41 59.85,64.45 59.85,60.8 62.71,60.8 64.45,59.05 80.64,59.05 81.28,58.42 83.82,58.42 86.36,60.96 91.28,60.96 v92.71,62.39 | v91.6,77.47 SV13.1
N$24  (via drill 0.51)
  Top 0.381: v84.93,60.96 85.57,61.59 85.57,72.87 SV13.2 | LED23.A 94.93,63.82 v94.93,65.88 | v96.84,65.88 96.68,66.04 v96.68,73.82
  Bottom 0.381: IC16.10 63.5,60.96 v84.93,60.96 | v96.84,65.88 v94.93,65.88 | v96.68,73.82 89.69,73.82 88.58,74.93 SV13.2
N$25  (via drill 0.51)
  Top 0.381: v58.42,58.74 IC16.6 | SV13.3 91.6,68.42 91.6,60.8 LED24.A
  Bottom 0.381: v58.42,58.74 58.74,58.42 64.29,58.42 66.2,56.52 88.27,56.52 91.44,59.69 LED24.A
N$26
  Top 0.381: SV13.4 90.96,66.52 90.96,59.85 94.93,55.88 LED25.A
  Bottom 0.381: IC16.3 52.7,57.78 63.98,57.78 65.88,55.88 LED25.A
N$27
  Top 0.381: SV13.5 90.33,64.61 90.33,59.53 92.71,57.15 LED26.A
  Bottom 0.381: IC17.13 56.52,53.98 66.36,53.98 66.83,54.45 84.14,54.45 86.52,52.07 LED26.A
N$28  (via drill 0.51)
  Top 0.381: IC4.13 24.92,67.79 v24.92,51.59
  Bottom 0.381: v24.92,51.59 26.99,51.59 27.62,50.96 27.62,48.1 30.96,48.1 33.5,45.56 39.69,45.56 40.48,44.77 44.93,44.77 45.24,45.09 46.35,45.09 IC17.2
N$29  (via drill 0.51)
  Top 0.381: IC6.11 73.18,49.05 73.18,43.97 IC6.3 72.23,43.18 72.23,39.53 71.28,38.58 71.28,29.84 | IC7.11 74.93,30.48 IC7.3 72.23,27.94 72.23,29.84 71.28,29.84 | 71.28,29.84 69.37,29.84 68.74,29.21 68.74,22.86 IC3.11 68.26,22.54 68.26,17.46 IC3.3 65.88,15.24 v65.88,9.37 | 48.18,16.43 49.37,17.62 49.37,22.7 IC2.11 | 48.18,16.43 IC2.3 | IC9.3 10.16,11.43 IC9.11 10.32,16.51 10.32,24.13 11.75,25.56 11.75,26.51 11.59,26.67 11.59,95.41 SV2.5 | SV6.4 26.67,7.62 IC8.3 28.1,8.89 28.1,14.13 IC8.11 | v48.26,9.37 48.26,16.35 48.18,16.43
  Bottom 0.381: SV2.5 14.76,98.58 41.12,98.58 41.91,97.79 41.91,94.46 46.2,94.46 SV5.9 | IC9.11 12.06,14.61 28.57,14.61 | IC8.11 28.57,14.61 | IC2.3 45.09,17.14 41.12,17.14 38.58,14.61 28.57,14.61 | v48.26,9.37 v65.88,9.37
N$30  (via drill 0.51)
  Top 0.381: LED9.A 42.55,36.2 42.55,45.24 41.04,46.75 | 41.04,46.75 40.01,47.78 40.01,50.16 IC4.5 | v25.56,72.23 25.88,71.91 v25.88,52.55 | IC7.9 79.22,36.35 79.22,41.59 78.9,41.91 v78.9,45.72 | v40.96,45.72 40.96,46.67 41.04,46.75
  Bottom 0.381: IC5.5 17.94,72.23 v25.56,72.23 | v25.88,52.55 26.19,52.23 37.94,52.23 IC4.5 | v78.9,45.72 72.07,45.72 71.75,46.04 65.56,46.04 65.25,45.72 v40.96,45.72
N$31  (via drill 0.51)
  Top 0.381: v18.89,26.99 18.89,39.53 V1.13
  Bottom 0.381: R3.1 41.27,26.04 26.99,26.04 26.19,26.83 19.05,26.83 v18.89,26.99
N$32  (via drill 0.51)
  Top 0.381: v31.91,27.3 v31.91,43.34
  Bottom 0.381: V1.14 17.3,43.66 21.27,43.66 21.59,43.34 v31.91,43.34 | v31.91,27.3 32.23,27.62 40.16,27.62 40.48,27.94 41.43,27.94 42.23,27.15 56.2,27.15 56.52,26.83 58.74,26.83 60.17,25.4 R4.1
N$33  (via drill 0.51)
  Top 0.381: v36.99,30.48 36.67,30.8 36.67,40.96 36.2,41.43 36.2,52.7 IC4.6 38.26,54.61 40.01,52.86 40.01,51.12 40.64,50.48 40.64,48.58 v40.96,48.26 | IC5.6 19.68,73.03 v19.68,59.53 | v80.01,47.31 IC6.9
  Bottom 0.381: v36.99,30.48 LED10.A | v19.68,59.53 20.95,58.26 26.67,58.26 30.32,54.61 IC4.6 | v80.01,47.31 79.69,47.62 64.61,47.62 63.98,48.26 v40.96,48.26
N$34  (via drill 0.51)
  Top 0.381: v78.58,32.38 78.58,41.27 77.47,42.39 IC6.5 | v29.37,57.15 29.37,69.06 26.51,71.91 26.51,72.71 25.24,73.98 v25.24,77.47 | LED11.A 50.96,35.4 v50.96,39.53 | v43.5,39.21 43.18,39.53 43.18,46.35 41.91,47.62 41.91,49.69 41.27,50.32 41.27,50.8 40.64,51.44 40.64,54.61 IC4.7
  Bottom 0.381: LED11.A 52.55,34.77 53.5,34.77 54.13,35.4 55.4,35.4 55.72,35.08 64.45,35.08 67.15,32.38 v78.58,32.38 | v29.37,57.15 IC4.7 | IC5.7 v25.24,77.47 | v50.96,39.53 50.64,39.21 v43.5,39.21
N$35  (via drill 0.51)
  Top 0.381: v45.88,12.7 45.88,19.37 48.1,21.59 48.1,27.15 45.88,29.37 v45.88,31.43 | v37.78,37.31 v37.78,31.43
  Bottom 0.381: v45.88,12.7 R1.1 | v45.88,31.43 45.72,31.27 37.94,31.27 v37.78,31.43 | v37.78,37.31 16.99,37.31 V1.11
N$36  (via drill 0.51)
  Top 0.381: v59.85,20.95 59.85,30.48 60.8,31.43 v60.8,36.67 | v76.04,33.97 76.04,38.26 v75.88,38.42 | v85.57,38.42 85.72,38.26 85.72,22.23 85.88,22.07 85.88,21.11 85.57,20.8 85.57,17.3 SV14.6 87.79,15.24 89.69,17.14 89.69,18.57 LED3.A
  Bottom 0.381: IC2.9 56.52,20.95 v59.85,20.95 | v60.8,36.67 61.12,36.35 65.72,36.35 66.83,37.47 67.79,37.47 68.74,36.51 68.74,33.66 75.72,33.66 v76.04,33.97 | v85.57,38.42 v75.88,38.42
N$37  (via drill 0.51)
  Top 0.381: v52.07,18.41 IC2.5 | LED2.A 94.3,24.45 94.3,24.29 92.71,22.7 89.69,22.7 89.69,19.84 SV14.7
  Bottom 0.381: v52.07,18.41 71.91,18.41 73.18,17.14 77.31,17.14 77.95,16.51 86.36,16.51 SV14.7
N$38  (via drill 0.51)
  Top 0.381: IC3.5 71.91,16.03 71.91,19.84 v72.07,20 | LED1.A 87.63,24.13 SV14.8
  Bottom 0.381: v72.07,20 72.39,19.68 80.64,19.68 81.28,19.05 86.36,19.05 SV14.8
N$39  (via drill 0.51)
  Top 0.381: v13.65,48.1 13.97,48.42 13.97,60.96 IC5.2 | SV1.6 50.96,4.92 v50.96,19.21 | v31.59,19.21 31.59,26.19 30.64,27.15 v30.64,27.3 | v23.34,33.81 23.34,40.32 23.81,40.8 24.92,40.8 v24.92,47.31
  Bottom 0.381: IC4.2 37.62,44.93 31.75,44.93 29.21,47.47 24.92,47.47 | 24.92,47.47 24.77,47.47 24.13,48.1 v13.65,48.1 | v31.59,19.21 v50.96,19.21 | v30.64,27.3 30.32,27.62 28.26,27.62 26.04,29.84 24.92,29.84 23.97,30.8 23.97,33.81 v23.34,33.81 | v24.92,47.31 24.92,47.47
N$40  (via drill 0.51)
  Top 0.381: v31.75,68.74 v31.75,49.53 31.59,49.53 30.96,48.9 v30.96,33.81 | SV1.8 53.18,7.78 53.18,24.13 47.94,29.37 46.83,29.37 46.83,32.38 v45.88,33.34
  Bottom 0.381: IC5.4 18.89,68.74 v31.75,68.74 | IC4.4 v31.75,49.53 | v45.88,33.34 45.72,33.18 36.51,33.18 35.88,33.81 v30.96,33.81
N$41  (via drill 0.51)
  Top 0.381: v26.51,50.64 26.51,12.38 23.97,9.84 23.97,7.46 R14.1
  Bottom 0.381: V1.16 17.62,50.64 v26.51,50.64
N$42  (via drill 0.51)
  Top 0.381: v34.29,65.25 v34.29,46.99 34.29,42.23 34.77,41.75 34.77,40.16 v35.08,39.85 | v36.2,6.03 36.67,6.51 v36.67,11.91 | v21.75,27.78 v21.75,11.91 | v24.92,27.78 24.61,28.1 24.61,30.16 24.29,30.48 v24.29,39.85
  Bottom 0.381: IC5.3 18.57,66.52 21.27,66.52 21.59,66.2 32.86,66.2 33.81,65.25 v34.29,65.25 | IC4.3 v34.29,46.99 | SV1.7 52.39,6.03 v36.2,6.03 | v21.75,11.91 v36.67,11.91 | v24.92,27.78 v21.75,27.78 | v35.08,39.85 v24.29,39.85
N$43  (via drill 0.51)
  Top 0.381: v29.37,54.13 29.37,51.59 29.53,51.44 29.53,47.47 28.42,46.35 v28.42,44.29 | v44.13,43.34 43.81,43.66 43.81,47.15 v43.66,47.31 | IC17.9 v63.5,47.31
  Bottom 0.381: V1.19 17.94,55.72 27.78,55.72 v29.37,54.13 | v28.42,44.29 35.88,44.29 36.83,43.34 v44.13,43.34 | v43.66,47.31 43.97,47.62 63.18,47.62 v63.5,47.31
N$44
  Top 0.381: IC7.1 68.1,28.73 68.1,33.66 | 68.1,33.66 68.1,33.81 IC7.13 | IC6.13 67.31,48.26 IC6.1 67.15,43.18 66.2,42.23 66.2,33.66 68.1,33.66
  Bottom 0.381: IC17.4 55.24,41.27 56.36,41.27 57.31,42.23 57.31,45.09 65.41,45.09 IC6.1
N$45  (via drill 0.51)
  Top 0.381: SV7.4 37.47,4.45 37.47,5.87 40.48,8.89 v40.48,20.16 | v78.9,18.73 79.22,18.41 79.22,16.03 SV15.1
  Bottom 0.381: v40.48,20.16 59.21,20.16 60.33,19.05 78.58,19.05 v78.9,18.73
N$46  (via drill 0.51)
  Top 0.381: R13.1 3.97,7.78 3.97,10.48 8.89,15.4 v8.89,34.61 | v13.81,34.61 13.97,34.77 13.97,43.02 14.61,43.66 14.61,45.09 V1.15
  Bottom 0.381: v13.81,34.61 v8.89,34.61
N$47  (via drill 0.51)
  Top 0.381: v59.85,17.46 59.85,12.22 60.48,11.59 62.07,11.59 v62.07,31.75 | v96.36,31.59 96.36,20.48 94.14,18.26 94.14,3.65 LED8.A
  Bottom 0.381: SV14.1 LED8.A | IC9.9 18.89,20.16 29.21,20.16 31.11,18.26 32.38,18.26 32.54,18.41 50.32,18.41 51.28,17.46 v59.85,17.46 | v62.07,31.75 77.79,31.75 78.11,31.43 83.98,31.43 84.14,31.59 v96.36,31.59
N$48  (via drill 0.51)
  Top 0.381: IC8.9 39.53,20.48 39.53,32.07 v39.69,32.23 | v59.85,46.67 v59.85,31.91 | v74.14,46.67 73.82,46.35 v73.82,37.47 | v81.12,37.47 81.12,22.38 79.85,21.11 79.85,17.94 81.28,16.51 84.45,16.51 84.45,15.88 84.93,15.4 84.93,12.86 86.36,11.43 91.6,11.43 91.6,7.3 92.55,6.35 LED7.A
  Bottom 0.381: LED7.A 92.55,6.19 89.69,6.19 88.58,5.08 SV14.2 | v39.69,32.23 39.85,32.38 47.31,32.38 47.78,31.91 v59.85,31.91 | v59.85,46.67 60.17,46.35 64.93,46.35 65.25,46.67 v74.14,46.67 | v81.12,37.47 v73.82,37.47
N$49  (via drill 0.51)
  Top 0.381: v33.02,2.22 33.02,6.51 34.45,7.94 34.45,11.11 36.2,12.86 39.53,12.86 v39.53,10 | v72.55,10.48 72.55,16.99 v73.66,18.1 | v78.11,17.78 78.26,17.62 v78.26,11.75
  Bottom 0.381: IC9.5 17.78,3.81 17.78,1.75 32.54,1.75 v33.02,2.22 | v39.53,10 39.85,10.32 46.83,10.32 47.78,11.27 59.85,11.27 60.8,10.32 66.52,10.32 66.67,10.48 v72.55,10.48 | v73.66,18.1 73.98,17.78 v78.11,17.78 | v78.26,11.75 78.58,11.43 86.36,11.43 | SV14.4 86.36,11.43 | LED5.A 90.17,11.43 86.36,11.43
N$50
  Top 0.381: R15.1 23.97,20.48 23.97,28.26 21.43,30.8 21.43,40.96 18.41,43.97 18.41,50.16 V1.17
N$51  (via drill 0.51)
  Top 0.381: v74.45,8.57 74.93,9.05 74.93,19.21 77.63,21.91 v77.63,22.7 | v98.27,22.7 98.9,22.07 98.9,13.81 LED6.A
  Bottom 0.381: IC8.5 34.92,6.99 66.36,6.99 68.1,8.73 74.3,8.73 v74.45,8.57 | v98.27,22.7 v77.63,22.7 | SV14.3 88.27,8.26 91.6,8.26 93.5,10.16 LED6.A
N$52  (via drill 0.51)
  Top 0.381: v71.28,2.06 71.28,5.08 73.82,7.62 75.88,7.62 v75.88,13.18
  Bottom 0.381: SV7.3 36.83,1.27 70.48,1.27 v71.28,2.06 | v75.88,13.18 76.04,13.34 77.15,13.34 79.06,15.24 SV15.2
N$53  (via drill 0.51)
  Top 0.381: IC14.10 61.75,76.99 61.75,79.69 62.07,80.01 v62.07,94.46
  Bottom 0.381: 86.84,94.46 v62.07,94.46 | SV12.2 86.84,94.46 | LED14.A 94.93,94.3 86.84,94.3 86.84,94.46
N$54  (via drill 0.51)
  Top 0.381: v5.08,29.84 R16.1 | v13.97,30.16 13.81,30.32 13.81,33.18 12.86,34.13 12.86,42.86 13.97,43.97 13.97,46.99 14.61,47.62 14.61,52.7 V1.18
  Bottom 0.381: v5.08,29.84 13.65,29.84 v13.97,30.16
N$55  (via drill 0.51)
  Top 0.381: V1.12 14.61,37.47 14.61,35.24 16.67,33.18 v16.67,13.02
  Bottom 0.381: v16.67,13.02 16.83,12.86 41.75,12.86 R2.1
N$56  (via drill 0.51)
  Top 0.381: v42.23,50.8 41.27,51.75 41.27,57.78 40.32,58.74 v40.32,63.5 40.32,73.5 41.75,74.93 41.75,78.11 43.34,79.69 43.34,88.42 43.02,88.74 43.02,89.69 43.34,90.01 43.34,91.12 43.42,91.2 | IC14.16 46.51,76.99 46.51,79.69 46.83,80.01 46.83,87.79 IC15.16 45.56,88.9 45.56,89.06 43.42,91.2 | 43.42,91.2 SV5.5 38.73,95.73 v38.73,84.61 | IC4.24 20.95,43.81 20.95,47.62 | IC4.21 20.95,47.62 | IC1.14 20.95,79.38 20.95,58.58 | 20.95,47.62 20.95,58.58 | 4.45,67.94 IC5.21 | 4.45,67.94 4.45,64.14 IC5.24 2.38,62.23 1.75,61.59 1.75,17.14 2.38,16.51 IC9.14 IC9.1 | SV2.2 5.4,96.2 5.4,68.74 4.6,67.94 4.45,67.94 | 20.95,58.58 16.51,58.58 V1.20 | 69.37,20 69.37,21.11 IC3.10 71.28,22.86 71.91,23.5 71.91,25.08 74.77,27.94 IC7.4 77.47,30.48 IC7.10 77.31,35.56 76.83,36.04 76.83,41.27 76.28,41.83 | 69.37,20 69.37,16.03 IC3.4 v68.58,7.78 | SV4.3 82.23,7.3 v79.06,7.3 | IC7.14 68.74,36.99 68.74,38.58 69.69,39.53 71.28,39.53 v71.28,41.27 | IC6.4 76.28,41.83 | IC6.10 76.36,49.69 76.36,41.91 76.28,41.83 | IC3.1 61.44,15.72 61.44,22.38 IC3.14 | IC2.4 50.01,15.72 50.01,20.8 IC2.10 | IC2.14 IC2.1 | IC9.4 12.7,11.43 IC9.10 | IC8.14 IC8.1 | IC8.4 31.27,9.68 31.27,14.76 IC8.10 33.18,16.51 33.18,21.75 V2.20 | v69.22,20 69.37,20
  Bottom 0.381: v42.23,50.8 IC17.16 | IC16.16 v40.32,63.5 | V1.20 V1.1 8.89,59.85 4.92,59.85 IC5.24 | v38.73,84.61 38.58,84.45 26.04,84.45 IC1.14 | v79.06,7.3 78.74,7.62 76.83,7.62 76.68,7.78 74.93,7.78 74.77,7.62 68.74,7.62 v68.58,7.78 | IC6.14 68.58,49.53 68.74,49.53 69.37,48.9 75.56,48.9 IC6.10 | v71.28,41.27 73.03,41.27 IC6.4 | V2.20 36.67,23.02 41.91,23.02 IC2.14 IC2.13 44.45,23.02 46.2,24.77 50.16,24.77 50.24,24.69 | 50.24,24.69 IC2.10 | 50.24,24.69 50.32,24.77 57.63,24.77 58.1,24.29 59.69,24.29 60.96,23.02 IC3.14 IC3.13 63.5,21.91 65.56,19.84 69.06,19.84 v69.22,20 | IC9.14 IC9.13 | IC9.1 4.45,10.79 8.26,10.79 | IC9.4 8.26,10.79 | IC8.14 IC8.13 | 24.69,10.72 24.77,10.79 28.57,10.79 IC8.4 | 24.69,10.72 IC8.1 | 8.26,10.79 24.61,10.79 24.69,10.72
N$57  (via drill 0.51)
  Top 0.381: SV7.2 31.91,3.97 31.91,13.02 34.45,15.56 34.45,20.64 38.73,24.92 v38.73,39.85 | v49.69,44.77 v49.69,40.16 | v54.77,44.77 54.77,38.26 56.2,36.83 v56.2,36.04 | v83.66,33.34 83.66,23.97 80.49,20.8 80.49,19.84 SV15.3
  Bottom 0.381: v38.73,39.85 39.05,40.16 v49.69,40.16 | v49.69,44.77 50.01,45.09 54.45,45.09 v54.77,44.77 | v56.2,36.04 56.52,35.72 64.77,35.72 67.47,33.02 77.79,33.02 78.11,33.34 v83.66,33.34
N$58  (via drill 0.51)
  Top 0.381: v64.29,17.3 64.61,17.62 v64.61,30.8 | v84.61,30.64 84.3,30.32 84.3,22.38 82.55,20.64 SV15.4
  Bottom 0.381: SV7.1 31.91,6.51 31.91,10.95 46.51,10.95 47.47,11.91 60.17,11.91 60.48,11.59 61.44,11.59 62.39,12.54 62.39,17.3 v64.29,17.3 | v64.61,30.8 84.45,30.8 v84.61,30.64
N$59
  Top 0.381: SV9.1 78.58,76.36 78.58,86.2 77.47,87.31 SV8.6
N$60  (via drill 0.51)
  Top 0.381: v74.61,69.53 74.61,91.12 SV8.5
  Bottom 0.381: SV9.2 82.23,69.53 v74.61,69.53
N$61  (via drill 0.51)
  Top 0.381: v73.18,67.79 73.18,84.3 72.39,85.09 SV8.4
  Bottom 0.381: SV9.3 82.07,67.79 v73.18,67.79
N$62  (via drill 0.51)
  Top 0.381: SV9.4 77.63,69.69 v77.63,82.87 | v71.91,82.87 71.75,83.03 71.75,89.53 SV8.3
  Bottom 0.381: v71.91,82.87 v77.63,82.87
N$63
  Top 0.381: SV3.8 SV17.1
N$64
  Top 0.381: SV17.2 80.01,92.71 SV3.7
N$65
  Top 0.381: SV3.6 79.38,94.61 79.38,90.81 SV17.3
N$66
  Top 0.381: SV17.4 78.74,88.9 78.74,92.71 SV3.5
N$67  (via drill 0.51)
  Top 0.381: SV3.4 73.03,95.89 73.03,93.34 73.66,92.71 v73.66,85.25 | v80.17,85.25 80.49,84.93 80.49,84.61 SV17.5
  Bottom 0.381: v80.17,85.25 v73.66,85.25
N$68  (via drill 0.51)
  Top 0.381: SV3.3 67.79,98.58 66.04,98.58 v66.04,88.27 | v79.22,87 79.22,83.34 SV17.6
  Bottom 0.381: v66.04,88.27 66.61,88.84 68.58,88.84 | 68.58,88.84 77.47,88.84 | v79.22,87 79.38,87 78.11,88.27 69.22,88.27 68.58,88.9 68.58,88.84
N$69  (via drill 0.51)
  Top 0.381: SV3.2 68.58,95.25 68.58,86.2 67.94,85.57 67.94,79.53 68.9,78.58 71.91,78.58 v71.91,77.47
  Bottom 0.381: SV17.7 v71.91,77.47
N$70  (via drill 0.51)
  Top 0.381: SV3.1 63.66,95.41 57.31,95.41 v57.31,86.36 | v75.56,74.93 v75.56,86.36
  Bottom 0.381: v75.56,86.36 v57.31,86.36 | SV17.8 v75.56,74.93
N$71  (via drill 0.51)
  Top 0.381: v65.56,28.89 65.56,37.78 v65.25,38.1
  Bottom 0.381: V2.2 35.24,29.53 39.21,29.53 39.53,29.84 47.31,29.84 48.1,29.05 57.31,29.05 57.63,28.73 62.71,28.73 62.87,28.89 v65.56,28.89 | R12.1 v65.25,38.1
N$72  (via drill 0.51)
  Top 0.381: V2.16 25.88,24.61 25.88,28.57 v25.56,28.89
  Bottom 0.381: V1.8 6.67,39.69 5.87,39.69 | 5.87,39.69 4.13,39.69 SV10.2 | v25.56,28.89 4.6,28.89 4.13,29.37 4.13,35.56 5.08,35.56 5.87,36.35 5.87,39.69
N$73  (via drill 0.51)
  Top 0.381: V2.3 30,32.23 30,45.09 30.32,45.4 v30.32,53.34
  Bottom 0.381: v30.32,53.34 50.64,53.34 52.23,51.75 52.23,48.9 58.9,48.9 59.85,49.85 59.85,53.34 R11.1
N$74  (via drill 0.51)
  Top 0.381: v3.81,22.23 SV10.1 6.35,36.83 V1.9
  Bottom 0.381: V2.15 20.95,22.23 v3.81,22.23
N$75  (via drill 0.51)
  Top 0.381: IC14.7 57.78,65.41 51.91,65.41 51.91,60.48 49.69,58.26 v49.69,49.21 | v43.66,68.74 v43.66,49.21 | v24.92,69.69 24.77,69.85 24.77,71.6 22.86,73.5 v22.86,76.36 | v13.49,76.36 13.49,94.77 13.97,95.25 13.97,97.79 14.76,98.58 22.86,98.58 SV2.9
  Bottom 0.381: v49.69,49.21 49.37,48.9 43.97,48.9 v43.66,49.21 | v43.66,68.74 33.18,68.74 32.23,69.69 v24.92,69.69 | v13.49,76.36 v22.86,76.36
N$76  (via drill 0.51)
  Top 0.381: IC1.6 36.35,75.41 36.35,80.64 35.72,81.28 v35.72,93.5 | SV2.6 v15.24,93.5
  Bottom 0.381: v15.24,93.5 15.56,93.82 28.89,93.82 29.15,93.56 29.9,93.56 30.17,93.82 35.4,93.82 v35.72,93.5
N$77  (via drill 0.51)
  Top 0.381: v93.82,63.5 93.98,63.66 93.98,75.88 96.36,78.26 96.36,83.98 95.25,85.09 LED16.A
  Bottom 0.381: IC14.3 53.34,66.04 59.16,66.04 60.06,65.14 60.38,65.14 60.5,65.27 63.96,65.27 65.64,63.58 68.66,63.58 68.74,63.5 v93.82,63.5 | SV12.4 88.27,89.53 90.49,89.53 93.66,86.36 LED16.A
N$78  (via drill 0.51)
  Top 0.381: v65.09,89.06 65.09,87.79 65.25,87.63 65.25,73.35 65.56,73.03 v65.56,70.17 | v84.93,88.9 85.57,89.53 85.57,90.65 SV12.3
  Bottom 0.381: IC14.6 60.33,70.48 65.25,70.48 v65.56,70.17 | 65.25,89.22 v65.09,89.06 65.5,89.47 67.81,89.47 68.51,90.17 68.65,90.17 69.35,89.47 77.97,89.47 78.67,90.17 80.01,90.17 81.28,88.9 v84.93,88.9 | LED15.A 90.65,92.23 88.11,92.23 SV12.3
N$79  (via drill 0.51)
  Top 0.381: v53.34,93.34 IC15.13 | v59.85,93.34 59.85,86.52 60.7,85.67 v60.7,85.46
  Bottom 0.381: v59.85,93.34 v53.34,93.34 | 85.57,83.82 91.44,83.82 LED18.A | SV12.5 85.57,85.57 85.57,83.82 | v60.7,85.46 61.33,85.46 61.59,85.72 62.23,85.72 62.6,85.36 62.6,84.72 63.13,84.19 68.53,84.19 68.73,83.98 70.97,83.98 71.61,84.63 71.61,85.09 72.54,85.09 73.29,84.35 74.03,84.35 74.3,84.61 79.53,84.61 79.8,84.35 80.54,84.35 80.68,84.49 81.35,83.82 85.57,83.82
N$80  (via drill 0.51)
  Top 0.381: RN3.3 77.47,6.35 85.57,6.35 85.57,4.6 86.36,3.81 91.12,3.81 v91.12,5.24
  Bottom 0.381: v91.12,5.24 94.14,5.24 LED7.K
N$81
  Top 0.381: R12.2 IC7.12
N$82
  Top 0.381: R8.2 LED11.K
N$83
  Bottom 0.381: IC6.12 R11.2
N$84  (via drill 0.51)
  Top 0.381: v90.01,72.23 89.69,72.55 89.69,77.95 SV12.8 | IC15.3 51.59,80.49 51.59,77.79 51.91,77.47 v51.91,71.75
  Bottom 0.381: LED21.A 94.14,72.23 v90.01,72.23 90.17,72.39 88.9,73.66 68.74,73.66 66.83,71.75 v51.91,71.75
N$85  (via drill 0.51)
  Top 0.381: LED20.A v92.71,81.12
  Bottom 0.381: IC15.6 59.85,79.85 59.85,74.3 66.83,74.3 68.74,76.2 91.44,76.2 LED20.A | SV12.7 88.27,81.92 91.76,81.92 92.55,81.12 v92.71,81.12
N$86
  Bottom 0.381: LED19.A 96.36,79.85 96.36,84.61 93.5,84.61 93.03,85.09 89.69,85.09 | SV12.6 89.69,85.09 | IC15.10 63.5,91.44 63.5,93.5 79.22,93.5 81.28,91.44 83.82,91.44 86.36,88.9 88.9,88.9 89.69,88.11 89.69,85.09
N$87  (via drill 0.51)
  Top 0.381: v43.97,89.22 v43.97,70.48 | v25.24,78.9 v25.24,89.85
  Bottom 0.381: IC14.2 46.35,70.48 v43.97,70.48 | v43.97,89.22 43.66,89.53 25.56,89.53 v25.24,89.85 | v25.24,78.9 3.65,78.9 IC5.17
N$88  (via drill 0.51)
  Top 0.381: v34.13,77.47 v34.13,80.49 | IC14.5 v55.88,74.14
  Bottom 0.381: IC5.9 19.84,80.49 v34.13,80.49 | v34.13,77.47 41.91,77.47 42.55,78.11 48.74,78.11 49.69,77.15 49.69,74.14 v55.88,74.14
N$89  (via drill 0.51)
  Top 0.381: v14.45,92.55 v14.45,82.55 | IC15.14 v50.8,93.34
  Bottom 0.381: v14.45,82.55 IC5.16 | v50.8,93.34 39.69,93.34 38.89,92.55 35.24,92.55 34.61,93.19 30.43,93.19 30.16,92.92 28.89,92.92 28.62,93.19 16.2,93.19 15.61,92.6 14.5,92.6 v14.45,92.55
N$90  (via drill 0.51)
  Top 0.381: v57.15,82.61 57.09,82.55 56.83,82.55 56.52,82.87 56.52,85.72 56.59,85.8 56.94,85.46 57.68,85.46 58.42,86.2 IC15.11
  Bottom 0.381: IC5.15 3.65,86.2 39.63,86.2 | 39.69,86.2 39.63,86.2 | 39.63,86.2 40.27,85.57 41.75,85.57 42.01,85.83 42.76,85.83 43.29,85.31 43.29,85.09 44.03,85.09 44.45,85.52 51.65,85.52 54.77,82.39 54.77,80.16 55.42,79.52 56.34,79.52 57.15,80.33 v57.15,82.61
N$91  (via drill 0.51)
  Top 0.381: v55.88,86.84 IC15.5 | v40.16,90.49 v40.16,92.39 | v19.84,90.81 19.68,90.65 19.68,89.69 18.73,88.74 15.72,88.74 v15.72,87.63
  Bottom 0.381: v55.88,86.84 56.04,87 56.36,87 56.99,87.63 56.99,92.39 v40.16,92.39 | IC5.14 v15.72,87.63 | v19.84,90.81 26.04,90.81 26.67,90.17 39.85,90.17 v40.16,90.49
N$92  (via drill 0.51)
  Top 0.381: v40.48,86.84 41.43,85.88 41.43,79.53 v41.59,79.38
  Bottom 0.381: IC5.13 3.97,88.74 20.32,88.74 22.23,86.84 v40.48,86.84 | v41.59,79.38 46.35,79.38 IC15.2
N$93
  Bottom 0.381: IC4.17 23.65,58.9 36.51,58.9 37.15,58.26 45.88,58.26 IC16.2
N$94  (via drill 0.51)
  Top 0.381: V2.19 34.13,25.24 34.13,41.43 33.34,42.23 33.34,71.6 35.4,73.66 v35.4,80.17 | v51.28,84.61 52.23,83.66 52.23,79.85 IC14.12
  Bottom 0.381: v35.4,80.17 35.88,80.64 40.48,80.64 44.45,84.61 v51.28,84.61
N$95  (via drill 0.51)
  Top 0.381: 44.61,54.77 44.61,44.29 IC17.1 45.4,43.34 v45.4,38.26 | IC16.1 44.61,54.77 | 45.01,67.87 44.61,67.47 44.61,54.77 | 45.01,67.87 IC14.1 | IC15.1 44.61,80.17 44.61,71.28 44.93,70.96 44.93,67.94 45.01,67.87 | v58.42,2.22 58.42,7.62 55.72,10.32 55.72,25.24 53.34,27.62 v53.34,38.58
  Bottom 0.381: SV4.2 81.92,5.71 77.79,5.71 76.36,7.14 75.25,7.14 74.93,6.83 67.94,6.83 65.88,4.76 65.88,1.91 58.74,1.91 v58.42,2.22 | v53.34,38.58 45.72,38.58 v45.4,38.26
N$96  (via drill 0.51)
  Top 0.381: v26.67,79.22 IC1.2 | v49.69,83.66 49.69,95.41 SV5.10
  Bottom 0.381: v26.67,79.22 40.01,79.22 44.45,83.66 v49.69,83.66
N$97
  Bottom 0.381: IC16.11 56.83,61.91 56.83,60.48 43.18,60.48 42.86,60.8 37.15,60.8 36.2,61.75 36.2,64.77 IC4.10
N$98  (via drill 0.51)
  Top 0.381: v27.78,72.07 27.78,89.06 SV2.8
  Bottom 0.381: IC14.4 49.85,72.07 v27.78,72.07
N$99  (via drill 0.51)
  Top 0.381: SV2.7 v17.78,91.76
  Bottom 0.381: IC15.12 53.29,91.49 35.41,91.49 34.34,92.55 30.69,92.55 30.43,92.28 28.63,92.28 28.36,92.55 18.57,92.55 v17.78,91.76
N$100  (via drill 0.51)
  Top 0.381: v12.86,65.88 12.7,65.72 12.7,44.45 v12.86,44.29 | v51.44,41.12 52.23,41.91 52.23,45.24 53.5,46.51 v53.5,46.67 | IC17.11 v58.42,46.67
  Bottom 0.381: IC4.15 22.07,65.56 19.37,65.56 19.05,65.88 v12.86,65.88 | v12.86,44.29 14.13,43.02 19.37,43.02 21.59,40.8 48.9,40.8 49.21,41.12 v51.44,41.12 | v58.42,46.67 v53.5,46.67
N$101  (via drill 0.51)
  Top 0.381: IC15.7 60.17,80.49 60.17,77.79 59.53,77.15 59.53,72.07 56.99,69.53 56.99,67.31 56.36,66.67 51.91,66.67 51.91,69.85 50.64,71.12 v49.37,71.12 | v4.45,73.34 4.45,94.61 SV2.1
  Bottom 0.381: v49.37,71.12 49.05,71.44 28.57,71.44 28.26,71.12 6.67,71.12 v4.45,73.34
N$102  (via drill 0.51)
  Top 0.381: IC16.5 v55.88,61.44
  Bottom 0.381: IC4.9 38.89,61.44 v55.88,61.44
N$103  (via drill 0.51)
  Top 0.381: IC16.12 52.23,59.85 v52.23,53.98 | v30.32,56.04 30.32,86.52 29.53,87.31 v29.53,94.46
  Bottom 0.381: v52.23,53.98 41.12,53.98 39.05,56.04 v30.32,56.04 | v29.53,94.46 12.22,94.46 SV2.4
N$104  (via drill 0.51)
  Top 0.381: v60.96,59.85 IC16.7 | v42.39,59.85 42.7,60.17 v42.7,76.83 | v37.94,76.52 37.94,83.98 36.67,85.25 36.67,95.41 SV5.4
  Bottom 0.381: v42.39,59.85 v60.96,59.85 | v42.7,76.83 38.26,76.83 v37.94,76.52
N$105  (via drill 0.51)
  Top 0.381: IC16.9 66.04,66.04 66.04,69.37 66.47,69.79 66.47,73.03 66.04,73.45 66.04,86.52 v66.83,87.31
  Bottom 0.381: v66.83,87.31 66.52,87 60.48,87 59.85,87.63 59.85,92.39 60.33,92.39 60.8,92.87 60.8,94.46 50.32,94.46 49.53,95.25 49.53,98.58 45.24,98.58 SV5.7
N$106
  Bottom 0.381: IC4.11 38.26,67.15 44.77,67.15 46.51,65.41 48.9,65.41 IC16.14
N$107  (via drill 0.51)
  Top 0.381: IC17.12 56.99,49.69 v56.99,37.94 | v50.01,36.35 v50.01,34.45 | v6.83,38.73 6.99,38.89 6.99,75.72 8.26,76.99 v8.26,83.98 | v22.86,87.79 v22.86,83.98 | SV5.2 v30.48,87.79
  Bottom 0.381: v56.99,37.94 54.13,37.94 53.18,36.99 53.18,35.4 51.59,35.4 50.64,34.45 v50.01,34.45 | v50.01,36.35 49.69,36.04 47.78,36.04 47.15,35.4 14.45,35.4 11.59,38.26 7.3,38.26 v6.83,38.73 | v22.86,83.98 v8.26,83.98 | v30.48,87.79 v22.86,87.79
N$108  (via drill 0.51)
  Top 0.381: SV5.1 v27.94,91.44 | IC17.7 60.96,48.58 59.85,49.68 59.85,59.52 59.52,59.85 59.52,64.73 v60.96,66.17 | v34.29,91.07 v34.29,87.74 | v39.64,87.74 40.53,88.63 v41.48,88.63 | v53.34,86.36 53.34,84.56 53.55,84.35 54.05,84.35 v54.11,84.4 | v67.04,83.29 67.31,83.02 v67.31,68.58 | v59.61,83.9 57.5,83.9 v57.42,83.82
  Bottom 0.381: v27.94,91.44 30.48,91.44 30.96,91.92 33.81,91.92 34.29,91.44 v34.29,91.07 | v60.96,66.17 61.61,66.81 63.96,66.81 65.72,68.58 v67.31,68.58 | v34.29,87.74 v39.64,87.74 | v41.48,88.63 42.49,87.63 44.77,87.63 45.26,87.14 51.26,87.14 51.75,87.63 52.07,87.63 v53.34,86.36 | v54.11,84.4 55.67,84.4 56.25,83.82 v57.42,83.82 | v67.04,83.29 62.87,83.29 62.25,83.9 v59.61,83.9
  other vias: 60.96,43.18
N$109
  Top 0.381: IC6.2 R10.2
N$110
  Top 0.381: IC7.2 R9.2
N$111
  Top 0.381: R16.2 IC9.12
N$112  (via drill 0.51)
  Top 0.381: IC16.4 53.18,55.72 53.18,53.02 52.23,52.07 v52.23,46.67 | v32.38,48.1 32.7,48.42 32.7,73.5 33.02,73.82 SV5.3
  Bottom 0.381: v52.23,46.67 51.91,46.35 41.75,46.35 40.8,47.31 40.16,47.31 39.37,48.1 v32.38,48.1
N$113  (via drill 0.51)
  Top 0.381: SV2.10 25.4,98.58 51.28,98.58 54.85,95.01 54.85,90.09 54.77,90.02 54.77,87.78 54.85,87.71 v54.85,85.32
  Bottom 0.381: IC14.9 62.07,77.63 62.07,83.19 60.17,83.19 59.69,82.71 59.69,82.55 59.37,82.55 58.88,83.05 58.42,83.05 58.42,84.77 56.2,84.77 55.67,85.3 55.24,85.3 55.23,85.32 v54.85,85.32
N$114
  Top 0.381: R15.2 IC8.12
N$115
  Top 0.381: IC8.2 R14.2
N$116
  Top 0.381: IC9.2 R13.2
N$117
  Bottom 0.381: IC3.12 R4.2
N$118
  Top 0.381: R3.2 IC2.12
N$119
  Top 0.381: IC2.2 R2.2
N$120
  Top 0.381: IC3.2 R1.2
N$121  (via drill 0.51)
  Top 0.381: v97.63,87.79 97.31,88.11 97.31,92.87 96.36,93.82 96.36,96.68 LED13.K
  Bottom 0.381: RN1.2 71.12,81.28 91.12,81.28 94.77,77.63 95.73,77.63 96.68,78.58 96.68,79.22 98.9,81.44 98.9,87.79 v97.63,87.79
N$122  (via drill 0.51)
  Top 0.381: v80.17,80.01 80.49,79.69 80.49,79.53 81.28,78.74 84.93,78.74 84.93,82.39 86.36,83.82 89.38,83.82 89.38,84.3 89.85,84.77 v89.85,93.34
  Bottom 0.381: v80.17,80.01 RN1.3 | v89.85,93.34 90.33,92.87 96.68,92.87 LED14.K
N$123  (via drill 0.51)
  Top 0.381: v93.66,77.31 94.14,77.79 94.14,89.06 LED15.K
  Bottom 0.381: RN1.4 71.12,78.74 92.23,78.74 v93.66,77.31
N$124  (via drill 0.51)
  Top 0.381: RN1.5 72.23,72.55 v72.23,71.44 | v90.65,71.12 90.96,71.44 90.96,76.68 90.65,76.99 90.65,83.66 91.44,84.45 v91.44,86.04
  Bottom 0.381: v72.23,71.44 80.96,71.44 81.28,71.12 v90.65,71.12 | v91.44,86.04 91.76,85.72 94.3,85.72 94.77,85.25 96.68,85.25 LED16.K
N$125  (via drill 0.51)
  Top 0.381: RN1.6 71.75,70.48 71.75,52.55 71.28,52.07 v71.28,45.09 | v98.11,46.04 98.9,46.83 98.9,88.27 v98.27,88.9 | v92.71,83.98 v92.71,88.74
  Bottom 0.381: v71.28,45.09 77.95,45.09 78.9,44.13 78.9,41.27 85.88,41.27 86.68,42.07 88.9,42.07 91.6,44.77 91.6,45.24 91.92,45.24 92.71,46.04 v98.11,46.04 | v98.27,88.9 98.11,88.74 v92.71,88.74 | v92.71,83.98 93.03,83.66 94.14,83.66 LED18.K
N$126  (via drill 0.51)
  Top 0.381: v76.52,70.48 76.52,89.85 76.2,90.17 76.2,92.71 73.66,95.25 73.66,97.79 74.45,98.58 85.57,98.58 85.57,97.31 86.36,96.52 94.14,96.52 94.14,92.87 96.68,90.33 96.68,84.61 97.79,83.5 LED19.K
  Bottom 0.381: RN1.7 70.48,70.48 v76.52,70.48
N$127  (via drill 0.51)
  Top 0.381: v78.9,49.21 v78.9,66.83 | v90.65,49.69 90.81,49.85 v90.81,57.63
  Bottom 0.381: RN1.8 70.33,66.83 v78.9,66.83 | v78.9,49.21 79.22,48.9 85.88,48.9 86.68,49.69 v90.65,49.69 | v90.81,57.63 91.76,58.58 93.19,58.58 94.14,59.53 94.14,60.8 96.68,60.8 98.9,63.02 98.9,74.93 LED20.K
N$128
  Bottom 0.381: RN1.9 70.96,65.88 81.12,65.88 81.28,66.04 89.85,66.04 93.82,70.01 96.68,70.01 LED21.K
N$129
  Top 0.381: RN2.2 89.69,48.74 91.44,48.74 91.44,49.05 94.14,51.75 94.14,53.18 96.36,55.4 96.36,64.93 95.89,65.41 95.89,66.67 LED22.K
N$130  (via drill 0.51)
  Top 0.381: LED23.K v97.79,57.31
  Bottom 0.381: RN2.3 88.11,48.74 91.12,48.74 94.14,51.75 94.14,54.77 95.73,54.77 96.68,55.72 96.68,57.31 v97.79,57.31
N$131
  Bottom 0.381: RN2.4 90.01,48.1 91.6,48.1 94.46,50.96 95.73,50.96 98.9,54.13 98.9,59.69 LED24.K
N$132  (via drill 0.51)
  Top 0.381: v96.68,46.99 96.68,54.77 LED25.K
  Bottom 0.381: RN2.5 88.42,43.97 89.38,43.97 92.39,46.99 v96.68,46.99
N$133
  Top 0.381: RN2.6 91.6,44.61 91.6,47.94 95.25,51.59 LED26.K
N$134
  Bottom 0.381: RN2.7 88.42,38.89 91.92,38.89 98.11,45.09 98.58,45.09 99.06,45.56 99.06,48.26 LED27.K
N$135
  Top 0.381: RN2.8 95.25,43.18 LED28.K
N$136
  Bottom 0.381: RN2.9 90.96,36.35 93.5,36.35 LED29.K
N$137
  Bottom 0.381: LED8.K 96.52,1.27 80.01,1.27 RN3.2
N$138
  Top 0.381: RN3.4 74.93,1.27 96.68,1.27 96.68,9.05 LED6.K
N$139  (via drill 0.51)
  Top 0.381: RN3.5 70.01,3.97 70.01,19.37 72.55,21.91 72.55,24.29 v74.14,25.88 | v98.27,26.83 98.9,26.19 98.9,24.77 97,22.86 97,18.57 96.36,17.94 96.36,15.08 LED5.K
  Bottom 0.381: v74.14,25.88 74.3,26.04 94.3,26.04 95.09,26.83 v98.27,26.83
N$140  (via drill 0.51)
  Top 0.381: v75.88,6.19 79.22,9.53 v79.22,13.97
  Bottom 0.381: RN3.6 69.69,6.19 v75.88,6.19 | v79.22,13.97 91.12,13.97 93.82,16.67 96.68,16.67 LED4.K
N$141  (via drill 0.51)
  Top 0.381: RN3.7 63.98,4.6 v63.98,11.27
  Bottom 0.381: v63.98,11.27 64.14,11.43 74.3,11.43 75.56,10.16 77.47,10.16 78.74,8.89 91.28,8.89 95.25,12.86 95.73,12.86 98.9,16.03 98.9,21.59 LED3.K
N$142  (via drill 0.51)
  Top 0.381: RN3.8 64.14,1.91 66.2,1.91 66.2,8.26 67.15,9.21 v67.15,9.53 | v92.55,7.78 92.23,8.1 92.23,12.86 91.6,13.49 91.6,18.89 94.14,21.43 94.14,22.86 v95.25,23.97
  Bottom 0.381: v67.15,9.53 77.15,9.53 78.42,8.26 79.53,8.26 80.49,7.3 80.49,6.35 88.9,6.35 90.17,7.62 92.39,7.62 v92.55,7.78 | v95.25,23.97 95.57,24.29 96.68,24.29 LED2.K
N$143  (via drill 0.51)
  Top 0.381: v64.93,5.87 64.93,16.51 66.04,17.62 v66.04,20.8 | v93.34,24.77 94.14,25.56 94.14,28.1 LED1.K
  Bottom 0.381: RN3.9 61.75,5.87 v64.93,5.87 | v66.04,20.8 66.2,20.95 71.6,20.95 72.55,21.91 72.55,24.77 v93.34,24.77
N$144
  Top 0.381: R5.2 LED9.K
N$145
  Top 0.381: R6.2 LED10.K
N$146
  Top 0.381: R17.2 LED12.K

### Text on the board
tPlace: EEPROM | ©Eric He 2019